# Altium project PCB_Project.PrjPcb (part 3 of 4)

## Sheet Regulators and Buck Converters.SchDoc
size A4; SheetNumber: 19; SheetTotal: 26
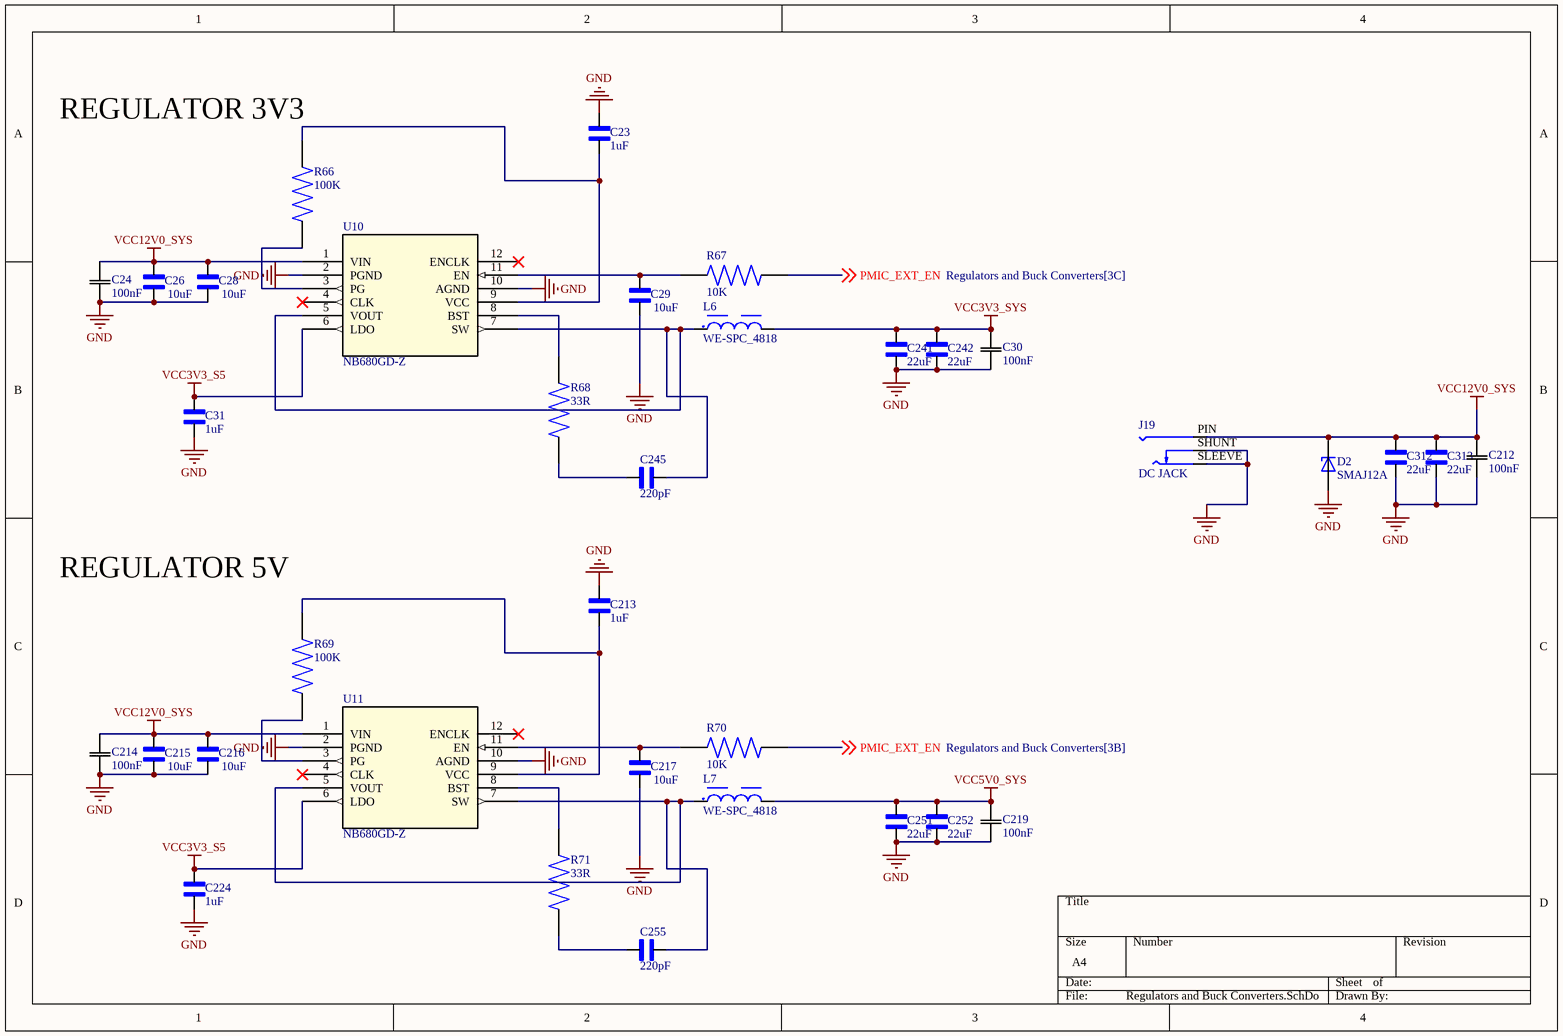
[diagram p18: Regulators and Buck Converters.SchDoc]

### Parts
C23  1uF  [CAPC1005X56N]
C24  100nF  [CAP_1005_TDK]
C26  10uF  [CAPC1005X70N]
C28  10uF  [CAPC1005X70N]
C29  10uF  [CAPC1005X70N]
C30  100nF  [CAP_1005_TDK]
C31  1uF  [CAPC1005X56N]
C212  100nF  [CAP_1005_TDK]
C213  1uF  [CAPC1005X56N]
C214  100nF  [CAP_1005_TDK]
C215  10uF  [CAPC1005X70N]
C216  10uF  [CAPC1005X70N]
C217  10uF  [CAPC1005X70N]
C219  100nF  [CAP_1005_TDK]
C224  1uF  [CAPC1005X56N]
C241  22uF  [CAPC2012X140N]
C242  22uF  [CAPC2012X140N]
C245  220pF  [CAPC1608X90]
C251  22uF  [CAPC2012X140N]
C252  22uF  [CAPC2012X140N]
C255  220pF  [CAPC1608X90]
C312  22uF  [CAPC2012X140N]
C313  22uF  [CAPC2012X140N]
D2  SMAJ12A  [DIOM4325X250N]
J19  DC JACK  [SWITCHCRAFT_RASM712PX]
L6  WE-SPC_4818  [WE-SPC_4818]
L7  WE-SPC_4818  [WE-SPC_4818]
R66  100K  [RES_ERA3ARB103V]
R67  10K  [RES_ERA3ARB103V]
R68  33R  [RES_ERA6AHD330V]
R69  100K  [RES_ERA3ARB103V]
R70  10K  [RES_ERA3ARB103V]
R71  33R  [RES_ERA6AHD330V]
U10  NB680GD-Z  [QFN-12_NB680_MNP]
U11  NB680GD-Z  [QFN-12_NB680_MNP]

### Nets
GND: C23.2 C24.1 C26.1 C28.1 C29.1 C30.1 C31.1 C212.1 C213.2 C214.1 C215.1 C216.1 C217.1 C219.1 C224.1 C241.2 C242.2 C251.2 C252.2 C312.2 C313.2 D2.A J19.SHUNT J19.SLEEVE U10.2(PGND) U10.10(AGND) U11.2(PGND) U11.10(AGND)
VCC3V3_S5: C31.2 C224.2 U10.6(LDO) U11.6(LDO)
VCC3V3_SYS: C30.2 C241.1 C242.1 L6.2
VCC5V0_SYS: C219.2 C251.1 C252.1 L7.2
VCC12V0_SYS: C24.2 C26.2 C28.2 C212.2 C214.2 C215.2 C216.2 C312.1 C313.1 D2.C J19.PIN U10.1(VIN) U11.1(VIN)
PMIC_EXT_EN: R67.2 R70.2 ; off-sheet PMIC_EXT_EN
NetC23_1: C23.1 R66.2 U10.9(VCC)
NetC29_2: C29.2 R67.1 U10.11(EN)
NetC213_1: C213.1 R69.2 U11.9(VCC)
NetC217_2: C217.2 R70.1 U11.11(EN)
NetC245_1: C245.1 L6.1 U10.5(VOUT) U10.7(SW)
NetC245_2: C245.2 R68.1
NetC255_1: C255.1 L7.1 U11.5(VOUT) U11.7(SW)
NetC255_2: C255.2 R71.1
NetR66_1: R66.1 U10.3(PG)
NetR68_2: R68.2 U10.8(BST)
NetR69_1: R69.1 U11.3(PG)
NetR71_2: R71.2 U11.8(BST)

Not connected (* = marked no-connect by the designer): U10 4(CLK)* 12(ENCLK)*; U11 4(CLK)* 12(ENCLK)*

### Notes on the sheet
- REGULATOR 3V3
- REGULATOR 5V

### Library data of the parts
C23 C31 C213 C224 = 0402ZD105KAT4A: 1 ÂµF Â±10% 10V Ceramic Capacitor X5R 0402 (1005 Metric); MF: AVX; SnapEDA_Link: https://www.snapeda.com/parts/0402ZD105KAT4A/AVX/view-part/?ref=snap; Package: 1005 AVX; Value: *; MP: 0402ZD105KAT4A; Check_prices: https://www.snapeda.com/parts/0402ZD105KAT4A/AVX/view-part/?ref=eda
C24 C30 C212 C214 C219 = C1005X7R1H104M050BB: Description; Manufacturer_Name: TDK; Copyright: Copyright (C) 2025 Ultra Librarian. All rights reserved.; Manufacturer_Part_Number: C1005X7R1H104M050BB
C26 C28 C29 C215-C217 = CL05A106MQ5NUNC: 10 ÂµF Â±20% 6.3V Ceramic Capacitor X5R 0402 (1005 Metric); MF: Samsung; SnapEDA_Link: https://www.snapeda.com/parts/CL05A106MQ5NUNC/Samsung/view-part/?ref=snap; Package: SMD-2 Samsung; Value: *; MP: CL05A106MQ5NUNC; Check_prices: https://www.snapeda.com/parts/CL05A106MQ5NUNC/Samsung/view-part/?ref=eda
C241 C242 C251 C252 C312 C313 = C0805C220J5GACTU: Capacitor, Ceramic, Cap, 22.0pF, Tol 5%, SMT, 50V, C0G | KEMET C0805C220J5GACTU; SnapEDA_Link: https://www.snapeda.com/parts/C0805C220J5GACTU/KEMET/view-part/?ref=snap; Package: 0805 Kemet; Value: *; MF: KEMET; MP: C0805C220J5GACTU; Check_prices: https://www.snapeda.com/parts/C0805C220J5GACTU/KEMET/view-part/?ref=eda
C245 C255 = CC0603KRX7R7BB221: 220 pF Â±10% 16V Ceramic Capacitor X7R 0603 (1608 Metric); MF: Yageo; SnapEDA_Link: https://www.snapeda.com/parts/CC0603KRX7R7BB221/Yageo/view-part/?ref=snap; Package: 0603 Yageo; Value: *; MP: CC0603KRX7R7BB221; Check_prices: https://www.snapeda.com/parts/CC0603KRX7R7BB221/Yageo/view-part/?ref=eda
D2 = SMAJ12A: 400W, 14V, 5%, Unidirectional, TVS; MF: Taiwan Semiconductor; SnapEDA_Link: https://www.snapeda.com/parts/SMAJ12A/taiwan/view-part/?ref=snap; Package: SMA-2 Taiwan Semiconductor; Value: *; MP: SMAJ12A; Check_prices: https://www.snapeda.com/parts/SMAJ12A/taiwan/view-part/?ref=eda
J19 = RASM712PX: Conn;AV;DC,Power;Jack;2.5mmPinSize;RtAngle;DCSeries;SMTMount | Switchcraft RASM712PX; MF: Switchcraft Inc.; SnapEDA_Link: https://www.snapeda.com/parts/RASM712PX/SWITCHCRAFT/view-part/?ref=snap; Package: None; Value: *; MP: RASM712PX; Check_prices: https://www.snapeda.com/parts/RASM712PX/SWITCHCRAFT/view-part/?ref=eda
L6 L7 = WE-SPC_4818: 10 ÂµH Shielded Drum Core, Wirewound Inductor 900 mA 248mOhm Max 1919 (4848 Metric); MF: WÃ¼rth Elektronik; MP: 74408941100; SnapEDA_Link: https://www.snapeda.com/parts/74408941100/W%25C3%25BCrth+Elektronik+Midcom/view-part/?ref=snap; Package: 1919 WÃ¼rth Elektronik; Value: *; Check_prices: https://www.snapeda.com/parts/74408941100/W%25C3%25BCrth+Elektronik+Midcom/view-part/?ref=eda
R66 R67 R69 R70 = ERA3ARB103V: MP: ERA3ARB103V; Availability: Unavailable; Package: None; Value: *; Price: None
R68 R71 = ERA6AHD330V: Package: None; MP: ERA6AHD330V; Price: None; Value: *; Availability: Unavailable
U10 U11 = NB680GD-Z: Wide Vin 4.8-26V Low Iq High Current Fixed 3.3V-8A Synchronous Buck Converter with 100mA LDO; Manufacturer_Name: Monolithic Power Systems; Copyright: Copyright (C) 2026 Ultra Librarian. All rights reserved.; Manufacturer_Part_Number: NB680GD-Z; Datasheet: https://www.monolithicpower.com/en/documentview/productdocument/index/version/2/document_type/Datasheet/lang/en/sku/NB680; RefDes: RefDes; Type: Type

## Sheet Power Supply for CPU Blocks.SchDoc
size 420 x 297 mm; SheetNumber: 20; SheetTotal: 26
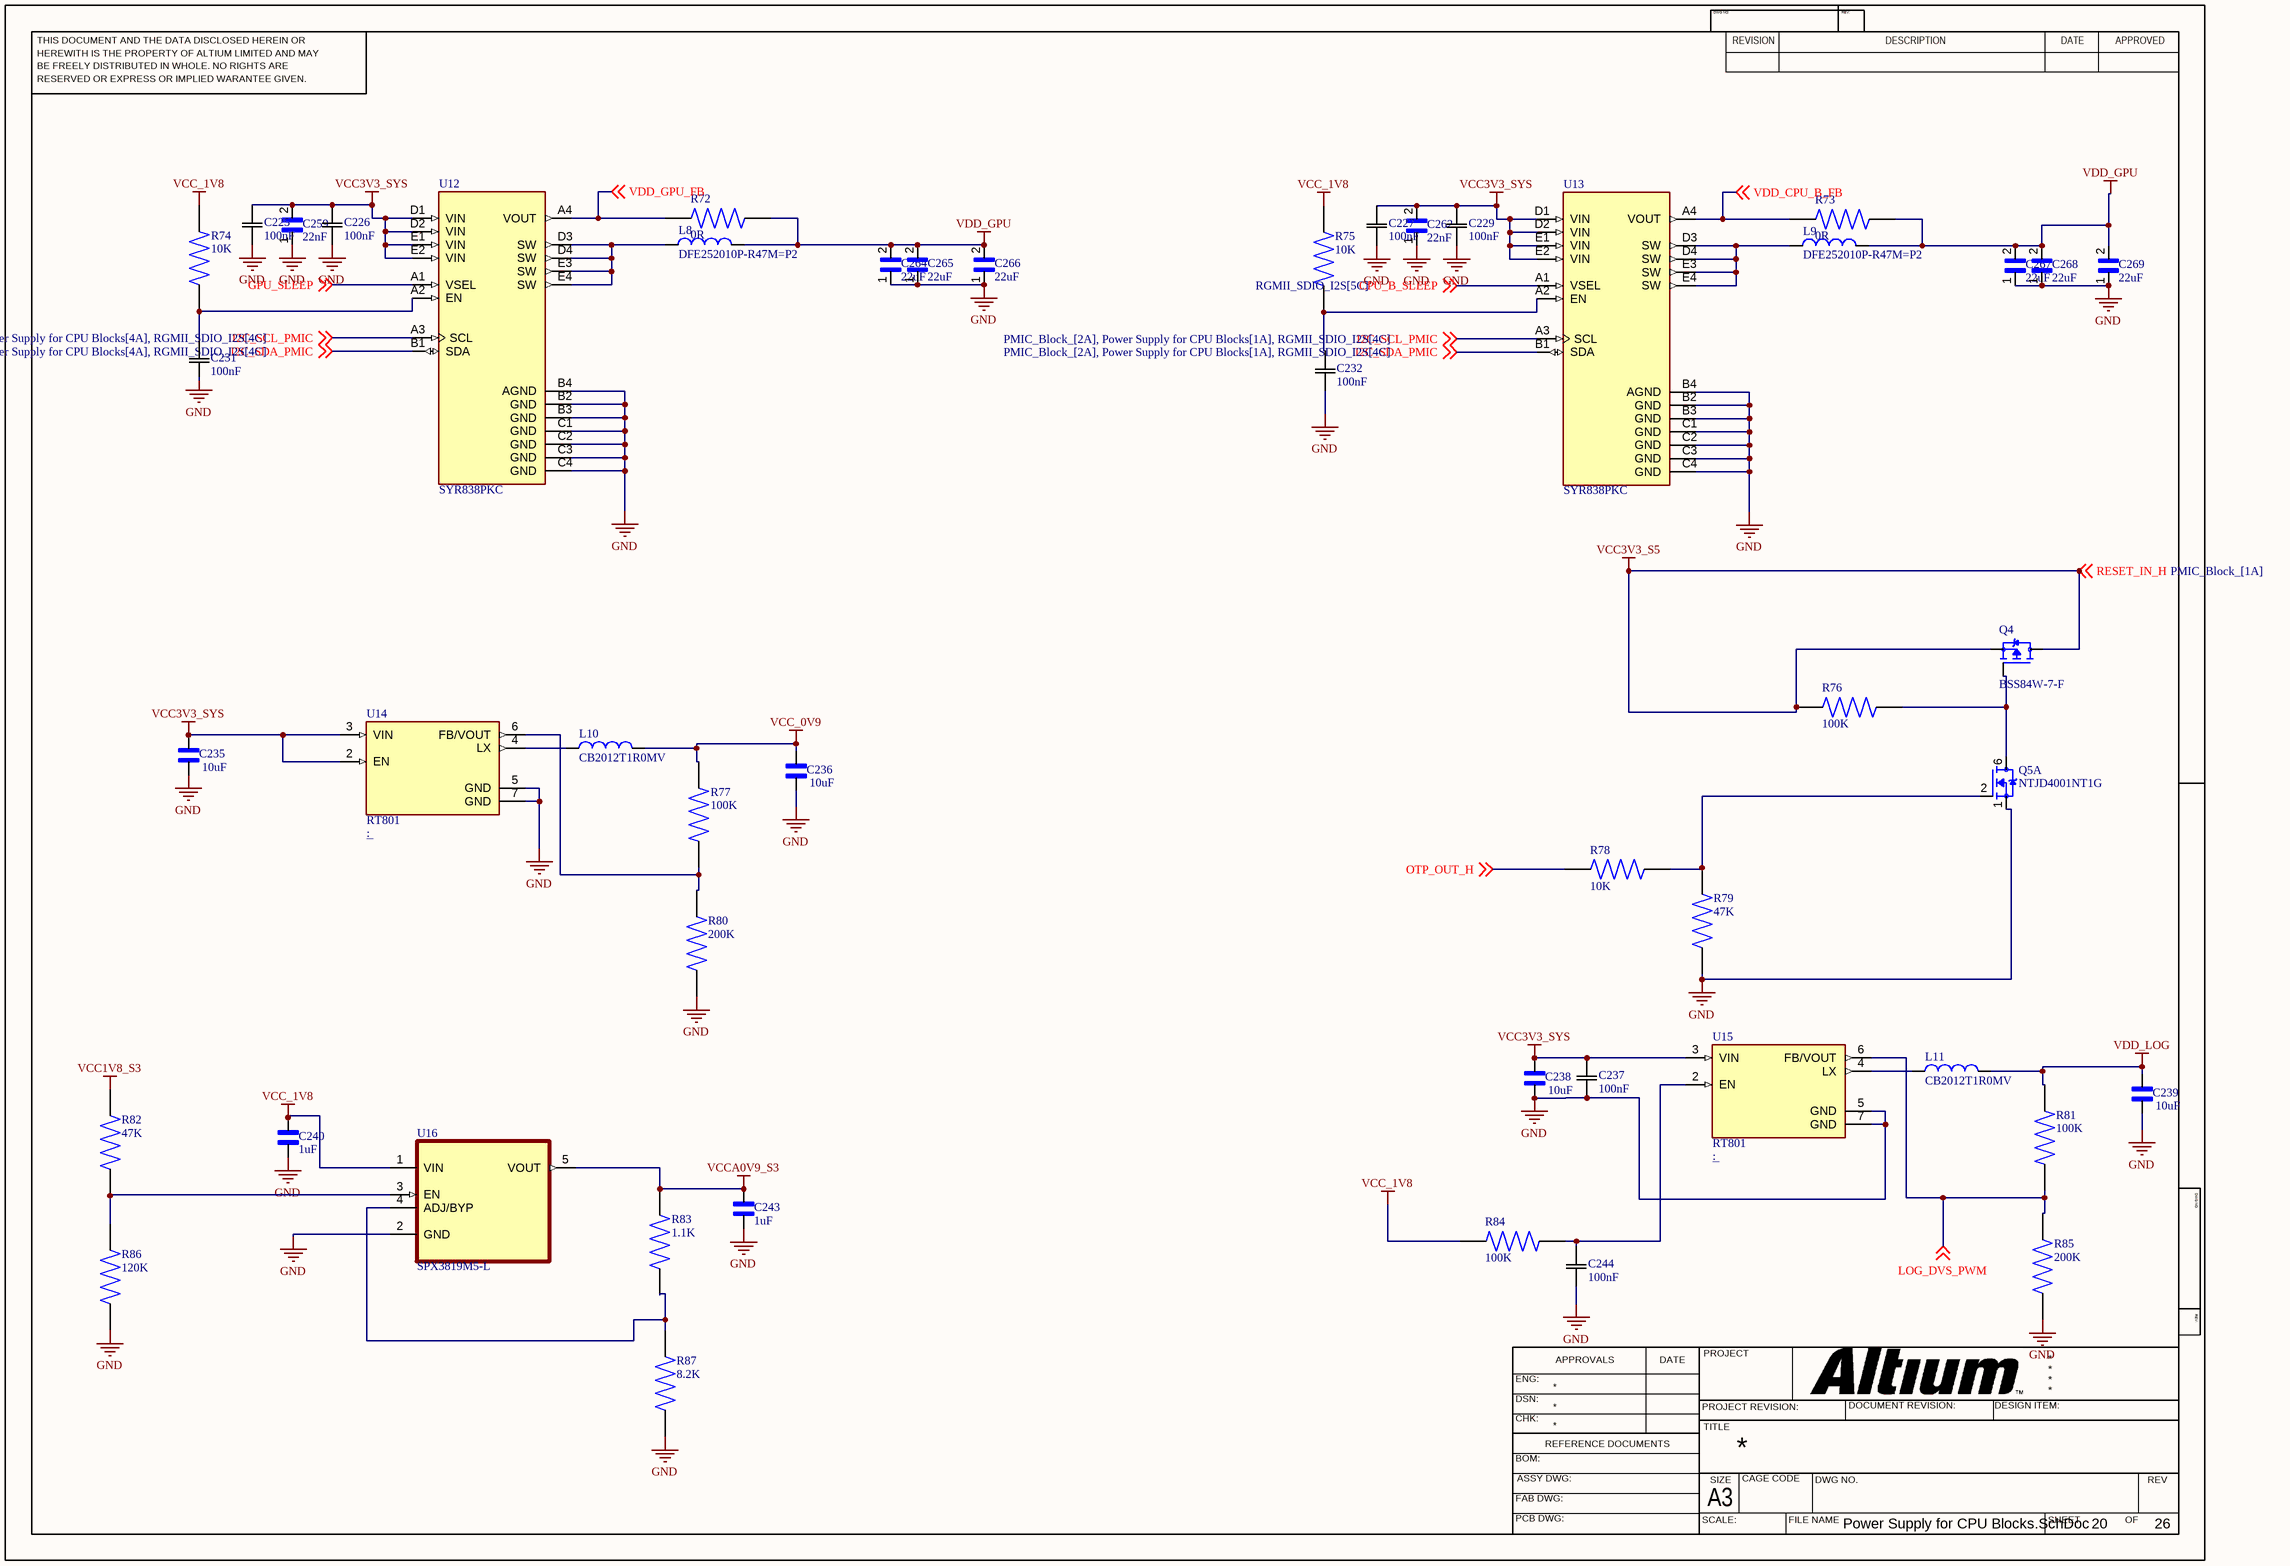
[diagram p19: Power Supply for CPU Blocks.SchDoc]

### Parts
C225  100nF  [CAP_1005_TDK]
C226  100nF  [CAP_1005_TDK]
C227  100nF  [CAP_1005_TDK]
C229  100nF  [CAP_1005_TDK]
C231  100nF  [CAP_1005_TDK]
C232  100nF  [CAP_1005_TDK]
C235  10uF  [CAPC1005X70N]
C236  10uF  [CAPC1005X70N]
C237  100nF  [CAP_1005_TDK]
C238  10uF  [CAPC1005X70N]
C239  10uF  [CAPC1005X70N]
C240  1uF  [CAPC1005X56N]
C243  1uF  [CAPC1005X56N]
C244  100nF  [CAP_1005_TDK]
C259  22nF  [CAPC6050X550N]
C262  22nF  [CAPC6050X550N]
C264  22uF  [CAPC6050X550N]
C265  22uF  [CAPC6050X550N]
C266  22uF  [CAPC6050X550N]
C267  22uF  [CAPC6050X550N]
C268  22uF  [CAPC6050X550N]
C269  22uF  [CAPC6050X550N]
L8  DFE252010P-R47M=P2  [INDC2520X100N]
L9  DFE252010P-R47M=P2  [INDC2520X100N]
L10  CB2012T1R0MV  [INDC2012X145N]
L11  CB2012T1R0MV  [INDC2012X145N]
Q4  BSS84W-7-F  [SOT65P222X110-3N]
Q5  NTJD4001NT1G  [SOT65P210X110-6N]  (part A of 2)
R72  0R  [RES_ERJH6G0R00V]
R73  0R  [RES_ERJH6G0R00V]
R74  10K  [RES_ERA3ARB103V]
R75  10K  [RES_ERA3ARB103V]
R76  100K  [RES_ERA3ARB103V]
R77  100K  [RES_ERA3ARB103V]
R78  10K  [RES_ERA3ARB103V]
R79  47K  [RES_ERA2ARC473X]
R80  200K  [RES_ERJP06D2003V]
R81  100K  [RES_ERA3ARB103V]
R82  47K  [RES_ERA2ARC473X]
R83  1.1K  [RESC1608X50N]
R84  100K  [RES_ERA3ARB103V]
R85  200K  [RES_ERJP06D2003V]
R86  120K  [RES_ERA8AEB124V]
R87  8.2K  [RES_ERA2APB822X]
U12  SYR838PKC  [BGA20N40P5X4_196X156X66N]
U13  SYR838PKC  [BGA20N40P5X4_196X156X66N]
U14  RT801  [SON65P200X200X80-7N]
U15  RT801  [SON65P200X200X80-7N]
U16  SPX3819M5-L  [SOT95P280X145-5N]

### Nets
GND: C225.1 C226.1 C227.1 C229.1 C231.1 C232.1 C235.1 C236.1 C237.1 C238.1 C239.1 C240.1 C243.1 C244.1 C259.1 C262.1 C264.1 C265.1 C266.1 C267.1 C268.1 C269.1 Q5.1(S1) R79.1 R80.1 R85.1 R86.1 R87.1 U12.B2(GND) U12.B3(GND) U12.B4(AGND) U12.C1(GND) U12.C2(GND) U12.C3(GND) U12.C4(GND) U13.B2(GND) U13.B3(GND) U13.B4(AGND) U13.C1(GND) U13.C2(GND) U13.C3(GND) U13.C4(GND) U14.5(GND) U14.7(GND) U15.5(GND) U15.7(GND) U16.2(GND)
VCC1V8_S3: R82.2
VCC3V3_S5: Q4.2(S) Q4.3(D) R76.2 ; off-sheet RESET_IN_H  [also labelled RESET_IN_H]
VCC3V3_SYS: C225.2 C226.2 C227.2 C229.2 C235.2 C237.2 C238.2 C259.2 C262.2 U12.D1(VIN) U12.D2(VIN) U12.E1(VIN) U12.E2(VIN) U13.D1(VIN) U13.D2(VIN) U13.E1(VIN) U13.E2(VIN) U14.2(EN) U14.3(VIN) U15.3(VIN)
VCC_0V9: C236.2 L10.2 R77.2
VCC_1V8: C240.2 R74.2 R75.2 R84.2 U16.1(VIN)
VCCA0V9_S3: C243.2 R83.2 U16.5(VOUT)
VDD_GPU: C264.2 C265.2 C266.2 C267.2 C268.2 C269.2 L8.2 L9.2 R72.2 R73.2
VDD_LOG: C239.2 L11.2 R81.2
CPU_B_SLEEP: U13.A1(VSEL) ; off-sheet CPU_B_SLEEP
GPU_SLEEP: U12.A1(VSEL) ; off-sheet GPU_SLEEP
I2C_SCL_PMIC: U12.A3(SCL) U13.A3(SCL) ; off-sheet I2C_SCL_PMIC
I2C_SDA_PMIC: U12.B1(SDA) U13.B1(SDA) ; off-sheet I2C_SDA_PMIC
LOG_DVS_PWM: R81.1 R85.2 U15.6(FB/VOUT) ; off-sheet LOG_DVS_PWM
OTP_OUT_H: R78.2 ; off-sheet OTP_OUT_H
VDD_CPU_B_FB: R73.1 U13.A4(VOUT) ; off-sheet VDD_CPU_B_FB
VDD_GPU_FB: R72.1 U12.A4(VOUT) ; off-sheet VDD_GPU_FB
NetC231_2: C231.2 R74.1 U12.A2(EN)
NetC232_2: C232.2 R75.1 U13.A2(EN)
NetC244_2: C244.2 R84.1 U15.2(EN)
NetL8_1: L8.1 U12.D3(SW) U12.D4(SW) U12.E3(SW) U12.E4(SW)
NetL9_1: L9.1 U13.D3(SW) U13.D4(SW) U13.E3(SW) U13.E4(SW)
NetL10_1: L10.1 U14.4(LX)
NetL11_1: L11.1 U15.4(LX)
NetQ4_1: Q4.1(G) Q5.6(D1) R76.1
NetQ5_2: Q5.2(G1) R78.1 R79.2
NetR77_1: R77.1 R80.2 U14.6(FB/VOUT)
NetR82_1: R82.1 R86.2 U16.3(EN)
NetR83_1: R83.1 R87.2 U16.4(ADJ/BYP)

### Notes on the sheet
- THIS DOCUMENT AND THE DATA DISCLOSED HEREIN OR
- HEREWITH IS THE PROPERTY OF ALTIUM LIMITED AND MAY
- DWG NO:
- REVISION
- REV:
- DESCRIPTION
- DATE
- APPROVED
- BE FREELY DISTRIBUTED IN WHOLE. NO RIGHTS ARE
- RESERVED OR EXPRESS OR IMPLIED WARANTEE GIVEN.
- ENG:
- APPROVALS
- PROJECT
- DSN:
- CHK:
- REFERENCE DOCUMENTS
- PROJECT REVISION:
- TITLE
- DOCUMENT REVISION:
- DESIGN ITEM:
- BOM:
- FAB DWG:
- PCB DWG:
- ASSY DWG:
- SCALE:
- A3
- SIZE
- CAGE CODE
- FILE NAME
- DWG NO.
- SHEET
- OF
- REV

### Library data of the parts
C225-C227 C229 C231 C232 C237 C244 = C1005X7R1H104M050BB: Description; Manufacturer_Name: TDK; Copyright: Copyright (C) 2025 Ultra Librarian. All rights reserved.; Manufacturer_Part_Number: C1005X7R1H104M050BB
C235 C236 C238 C239 = CL05A106MQ5NUNC: as C26 on sheet Regulators and Buck Converters; SnapEDA_Link: https://www.snapeda.com/parts/CL05A106MQ5NUNC/Samsung/view-part/?ref=snap; Package: SMD-2 Samsung; Value: *; MP: CL05A106MQ5NUNC; Check_prices: https://www.snapeda.com/parts/CL05A106MQ5NUNC/Samsung/view-part/?ref=eda
C240 C243 = 0402ZD105KAT4A: as C23 on sheet Regulators and Buck Converters; SnapEDA_Link: https://www.snapeda.com/parts/0402ZD105KAT4A/AVX/view-part/?ref=snap; Package: 1005 AVX; Value: *; MP: 0402ZD105KAT4A; Check_prices: https://www.snapeda.com/parts/0402ZD105KAT4A/AVX/view-part/?ref=eda
C259 C262 C264-C269 = CKG57NX7S1H226M500JJ: 22ÂµF Â±20% 50V Ceramic Capacitor X7S Stacked SMD, 2 J-Lead; MP: CKG57NX7S1H226M500JJ; Package: None; Availability: Unavailable; Price: None; Value: *
L8 L9 = DFE252010P-R47M=P2: INDUCTOR, SHLD, 0.47UH, 20%, 4.1A, 1008; Package: None; Price: None; Value: *; MP: DFE252010P-R47M=P2; Availability: Unavailable
L10 L11 = CB2012T1R0MV: 1 ÂµH Unshielded Drum Core, Wirewound Inductor 700 mA 195mOhm Max 0805 (2012 Metric); MF: Taiyo Yuden; SnapEDA_Link: https://www.snapeda.com/parts/CB2012T1R0MV/Taiyo+Yuden/view-part/?ref=snap; Package: 2012 Taiyo Yuden; Value: *; MP: CB2012T1R0MV; Check_prices: https://www.snapeda.com/parts/CB2012T1R0MV/Taiyo+Yuden/view-part/?ref=eda
Q4 = BSS84W-7-F: P-Channel 50 V 130mA (Ta) 200mW (Ta) Surface Mount SOT-323; MF: Diodes Inc.; SnapEDA_Link: https://www.snapeda.com/parts/BSS84W-7-F/Diodes+Inc./view-part/?ref=snap; Availability: In Stock; Check_prices: https://www.snapeda.com/parts/BSS84W-7-F/Diodes+Inc./view-part/?ref=eda; MP: BSS84W-7-F; Price: None; Purchase-URL: https://pricing.snapeda.com/search/part/BSS84W-7-F/?ref=eda; Package: SOT-323 Diodes Inc.; Value: *
Q5 = NTJD4001NT1G: Mosfet Array 2 N-Channel (Dual) 30V 250mA 272mW Surface Mount SC-88/SC70-6/SOT-363; MF: ON Semiconductor; SnapEDA_Link: https://www.snapeda.com/parts/NTJD4001NT1G/Onsemi/view-part/?ref=snap; Package: SC-88-6 ON Semiconductor; Value: *; MP: NTJD4001NT1G; Check_prices: https://www.snapeda.com/parts/NTJD4001NT1G/Onsemi/view-part/?ref=eda
R72 R73 = ERJH6G0R00V: MP: ERJH6G0R00V; Value: *; Availability: Unavailable; Price: None; Package: None
R74-R78 R81 R84 = ERA3ARB103V: MP: ERA3ARB103V; Availability: Unavailable; Package: None; Value: *; Price: None
R79 R82 = ERA2ARC473X: Value: *; MP: ERA2ARC473X; Package: None; Availability: Unavailable; Price: None
R80 R85 = ERJP06D2003V: Package: None; Value: *; Price: None; MP: ERJP06D2003V; Availability: Unavailable
R83 = ERJP08F1101V: Package: None; Value: *; MP: ERJP08F1101V; Price: None; Availability: Unavailable
R86 = ERA8AEB124V: Availability: Unavailable; MP: ERA8AEB124V; Price: None; Package: None; Value: *
R87 = ERA2APB822X: Price: None; Value: *; Availability: Unavailable; Package: None; MP: ERA2APB822X
U12 U13 = SYR838PKC: MF: Silergy; SnapEDA_Link: https://www.snapeda.com/parts/SYR838PKC/Silergy/view-part/?ref=snap; Package: None; Value: *; MP: SYR838PKC; Check_prices: https://www.snapeda.com/parts/SYR838PKC/Silergy/view-part/?ref=eda
U14 U15 = RT8010GQW: Buck Switching Regulator IC Positive Adjustable 0.6V 1 Output 1A 6-WDFN Exposed Pad; MF: Richtek USA; SnapEDA_Link: https://www.snapeda.com/parts/RT8010GQW/Richtek%20USA%20Inc./view-part/641358/?ref=snap; Value: *; MP: RT8010GQW; Package: WDFN-6 Richtek
U16 = SPX3819M5-L: Linear Voltage Regulator IC Positive Adjustable 1 Output 500mA SOT-23-5; MF: MaxLinear, Inc.; MP: SPX3819M5-L/TR; SnapEDA_Link: https://www.snapeda.com/parts/SPX3819M5-L/TR/MaxLinear/view-part/?ref=snap; Package: SOT-23-5 Exar; Value: *; Check_prices: https://www.snapeda.com/parts/SPX3819M5-L/TR/MaxLinear/view-part/?ref=eda

## Sheet MIPI CSI 0 and 1 Connectors.SchDoc
size 420 x 297 mm; SheetNumber: 21; SheetTotal: 26
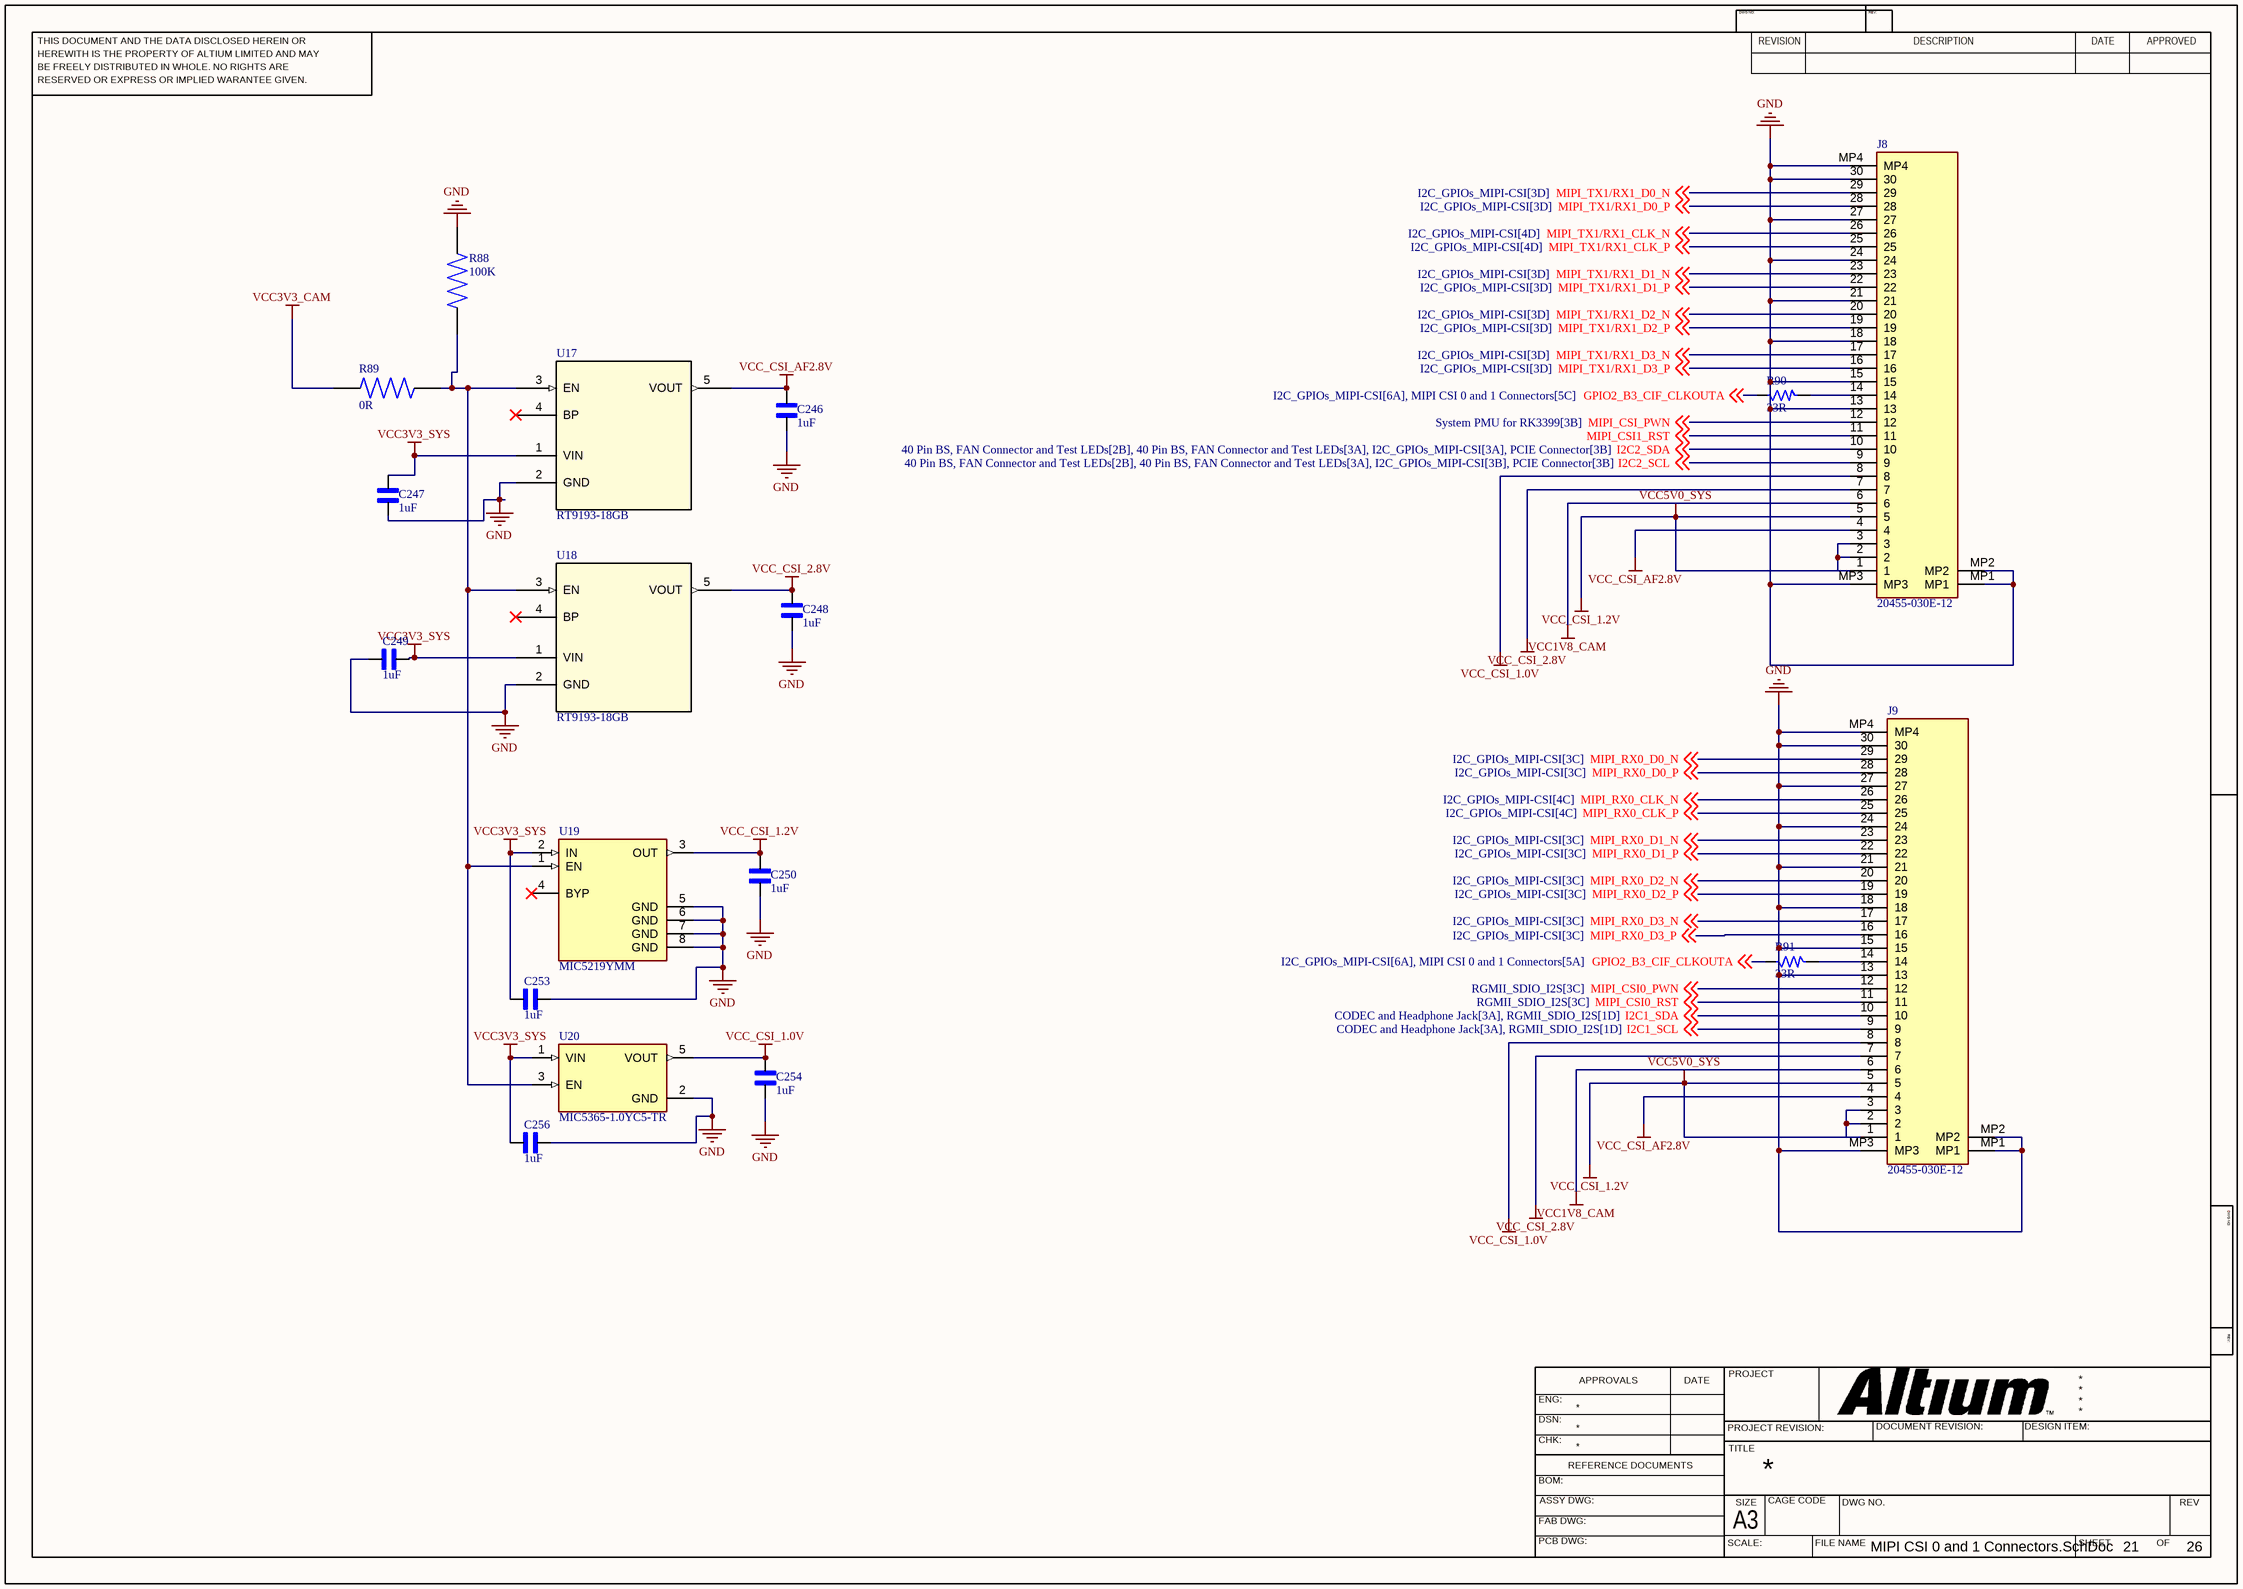
[diagram p20: MIPI CSI 0 and 1 Connectors.SchDoc]

### Parts
C246  1uF  [CAPC1005X56N]
C247  1uF  [CAPC1005X56N]
C248  1uF  [CAPC1005X56N]
C249  1uF  [CAPC1005X56N]
C250  1uF  [CAPC1005X56N]
C253  1uF  [CAPC1005X56N]
C254  1uF  [CAPC1005X56N]
C256  1uF  [CAPC1005X56N]
J8  20455-030E-12  [20455030E12]
J9  20455-030E-12  [20455030E12]
R88  100K  [RES_ERA3ARB103V]
R89  0R  [RES_ERJH6G0R00V]
R90  33R  [RESC1608X50N]
R91  33R  [RESC1608X50N]
U17  RT9193-18GB  [SOT-23-5_RIT]
U18  RT9193-18GB  [SOT-23-5_RIT]
U19  MIC5219YMM  [SOP65P490X110-8N]
U20  MIC5365-1.0YC5-TR  [SOT65P210X110-5N]

### Nets
GND: C246.1 C247.1 C248.1 C249.2 C250.1 C253.1 C254.1 C256.1 J8.13 J8.15 J8.18 J8.21 J8.24 J8.27 J8.30 J8.MP1 J8.MP2 J8.MP3 J8.MP4 J9.13 J9.15 J9.18 J9.21 J9.24 J9.27 J9.30 J9.MP1 J9.MP2 J9.MP3 J9.MP4 R88.2 U17.2(GND) U18.2(GND) U19.5(GND) U19.6(GND) U19.7(GND) U19.8(GND) U20.2(GND)
VCC1V8_CAM: J8.6 J9.6
VCC3V3_CAM: R89.1
VCC3V3_SYS: C247.2 C249.1 C253.2 C256.2 U17.1(VIN) U18.1(VIN) U19.2(IN) U20.1(VIN)
VCC5V0_SYS: C250.2 J8.1 J8.2 J8.3 J8.5 J9.1 J9.2 J9.3 J9.5 U19.3(OUT)  [also labelled VCC_CSI_1.2V]
VCC_CSI_1.0V: C254.2 J8.8 J9.8 U20.5(VOUT)
VCC_CSI_2.8V: C248.2 J8.7 J9.7 U18.5(VOUT)
VCC_CSI_AF2.8V: C246.2 J8.4 J9.4 U17.5(VOUT)
GPIO2_B3_CIF_CLKOUTA: R90.1 R91.1 ; off-sheet GPIO2_B3_CIF_CLKOUTA
I2C1_SCL: J9.9 ; off-sheet I2C1_SCL
I2C1_SDA: J9.10 ; off-sheet I2C1_SDA
I2C2_SCL: J8.9 ; off-sheet I2C2_SCL
I2C2_SDA: J8.10 ; off-sheet I2C2_SDA
MIPI_CSI0_PWN: J9.12 ; off-sheet MIPI_CSI0_PWN
MIPI_CSI0_RST: J9.11 ; off-sheet MIPI_CSI0_RST
MIPI_CSI1_RST: J8.11 ; off-sheet MIPI_CSI1_RST
MIPI_CSI_PWN: J8.12 ; off-sheet MIPI_CSI_PWN
MIPI_RX0_CLK_N: J9.26 ; off-sheet MIPI_RX0_CLK_N
MIPI_RX0_CLK_P: J9.25 ; off-sheet MIPI_RX0_CLK_P
MIPI_RX0_D0_N: J9.29 ; off-sheet MIPI_RX0_D0_N
MIPI_RX0_D0_P: J9.28 ; off-sheet MIPI_RX0_D0_P
MIPI_RX0_D1_N: J9.23 ; off-sheet MIPI_RX0_D1_N
MIPI_RX0_D1_P: J9.22 ; off-sheet MIPI_RX0_D1_P
MIPI_RX0_D2_N: J9.20 ; off-sheet MIPI_RX0_D2_N
MIPI_RX0_D2_P: J9.19 ; off-sheet MIPI_RX0_D2_P
MIPI_RX0_D3_N: J9.17 ; off-sheet MIPI_RX0_D3_N
MIPI_RX0_D3_P: J9.16 ; off-sheet MIPI_RX0_D3_P
MIPI_TX1/RX1_CLK_N: J8.26 ; off-sheet MIPI_TX1/RX1_CLK_N
MIPI_TX1/RX1_CLK_P: J8.25 ; off-sheet MIPI_TX1/RX1_CLK_P
MIPI_TX1/RX1_D0_N: J8.29 ; off-sheet MIPI_TX1/RX1_D0_N
MIPI_TX1/RX1_D0_P: J8.28 ; off-sheet MIPI_TX1/RX1_D0_P
MIPI_TX1/RX1_D1_N: J8.23 ; off-sheet MIPI_TX1/RX1_D1_N
MIPI_TX1/RX1_D1_P: J8.22 ; off-sheet MIPI_TX1/RX1_D1_P
MIPI_TX1/RX1_D2_N: J8.20 ; off-sheet MIPI_TX1/RX1_D2_N
MIPI_TX1/RX1_D2_P: J8.19 ; off-sheet MIPI_TX1/RX1_D2_P
MIPI_TX1/RX1_D3_N: J8.17 ; off-sheet MIPI_TX1/RX1_D3_N
MIPI_TX1/RX1_D3_P: J8.16 ; off-sheet MIPI_TX1/RX1_D3_P
NetJ8_14: J8.14 R90.2
NetJ9_14: J9.14 R91.2
NetR88_1: R88.1 R89.2 U17.3(EN) U18.3(EN) U19.1(EN) U20.3(EN)

Not connected (* = marked no-connect by the designer): U17 4(BP)*; U18 4(BP)*; U19 4(BYP)*

### Notes on the sheet
- THIS DOCUMENT AND THE DATA DISCLOSED HEREIN OR
- HEREWITH IS THE PROPERTY OF ALTIUM LIMITED AND MAY
- DWG NO:
- REVISION
- REV:
- DESCRIPTION
- DATE
- APPROVED
- BE FREELY DISTRIBUTED IN WHOLE. NO RIGHTS ARE
- RESERVED OR EXPRESS OR IMPLIED WARANTEE GIVEN.
- ENG:
- APPROVALS
- PROJECT
- DSN:
- CHK:
- REFERENCE DOCUMENTS
- PROJECT REVISION:
- TITLE
- DOCUMENT REVISION:
- DESIGN ITEM:
- BOM:
- FAB DWG:
- PCB DWG:
- ASSY DWG:
- SCALE:
- A3
- SIZE
- CAGE CODE
- FILE NAME
- DWG NO.
- SHEET
- OF
- REV

### Library data of the parts
C246-C250 C253 C254 C256 = 0402ZD105KAT4A: as C23 on sheet Regulators and Buck Converters; SnapEDA_Link: https://www.snapeda.com/parts/0402ZD105KAT4A/AVX/view-part/?ref=snap; Package: 1005 AVX; Value: *; MP: 0402ZD105KAT4A; Check_prices: https://www.snapeda.com/parts/0402ZD105KAT4A/AVX/view-part/?ref=eda
J8 J9 = 20455-030E-12: Board Connector, 30 Contact(s), 1 Row(s), Female, Right Angle, Surface Mount Terminal, Receptacle; Manufacturer_Name: I-Pex; Geometry.Height: 1.1mm; Manufacturer_Part_Number: 20455-030E-12; Mouser Part Number: *; Mouser Price/Stock: *; Arrow Part Number: *; Arrow Price/Stock: *; Datasheet Link: https://www.datasheet5.com/part/20455-030E-12/I-PEX%20Co%20Ltd
R88 = ERA3ARB103V: MP: ERA3ARB103V; Availability: Unavailable; Package: None; Value: *; Price: None
R89 = ERJH6G0R00V: MP: ERJH6G0R00V; Value: *; Availability: Unavailable; Price: None; Package: None
R90 R91 = RES_33R-0.1W-1%-0402: 33 Ohms ±1% 0.1W, 1/10W Chip Resistor 0402 (1005 Metric) Automotive AEC-Q200 Thick Film; Manufacturer: Panasonic Electronic Components; Manufacturer Part Number: ERJ-2RKF33R0X; Case/Package: 0402; Supplier-1: Digikey
U17 U18 = RT9193-18GB: Description; Manufacturer_Name: Richtek Technology; Copyright: Copyright (C) 2026 Ultra Librarian. All rights reserved.; Manufacturer_Part_Number: RT9193-18GB; RefDes: RefDes; Type: Type
U19 = MIC5219YMM: MIC5219 Series 500 mA ADJ Output Voltage Surface Mount LDO Regulator - MSOP-8; MF: Microchip; SnapEDA_Link: https://www.snapeda.com/parts/MIC5219YMM/Microchip+Technology/view-part/?ref=snap; Package: MSOP-8 Microchip; Value: *; MP: MIC5219YMM; Check_prices: https://www.snapeda.com/parts/MIC5219YMM/Microchip+Technology/view-part/?ref=eda
U20 = MIC5365-1.0YC5-TR: Linear Voltage Regulator IC Positive Fixed 1 Output 150mA SC-70-5; MF: Microchip; SnapEDA_Link: https://www.snapeda.com/parts/MIC5365-1.0YC5-TR/Microchip+Technology/view-part/?ref=snap; Package: SC-70-5 Microchip; Value: *; MP: MIC5365-1.0YC5-TR; Check_prices: https://www.snapeda.com/parts/MIC5365-1.0YC5-TR/Microchip+Technology/view-part/?ref=eda

## Sheet EDP and MIPI DSI Connectors.SchDoc
size A4; SheetNumber: 22; SheetTotal: 26
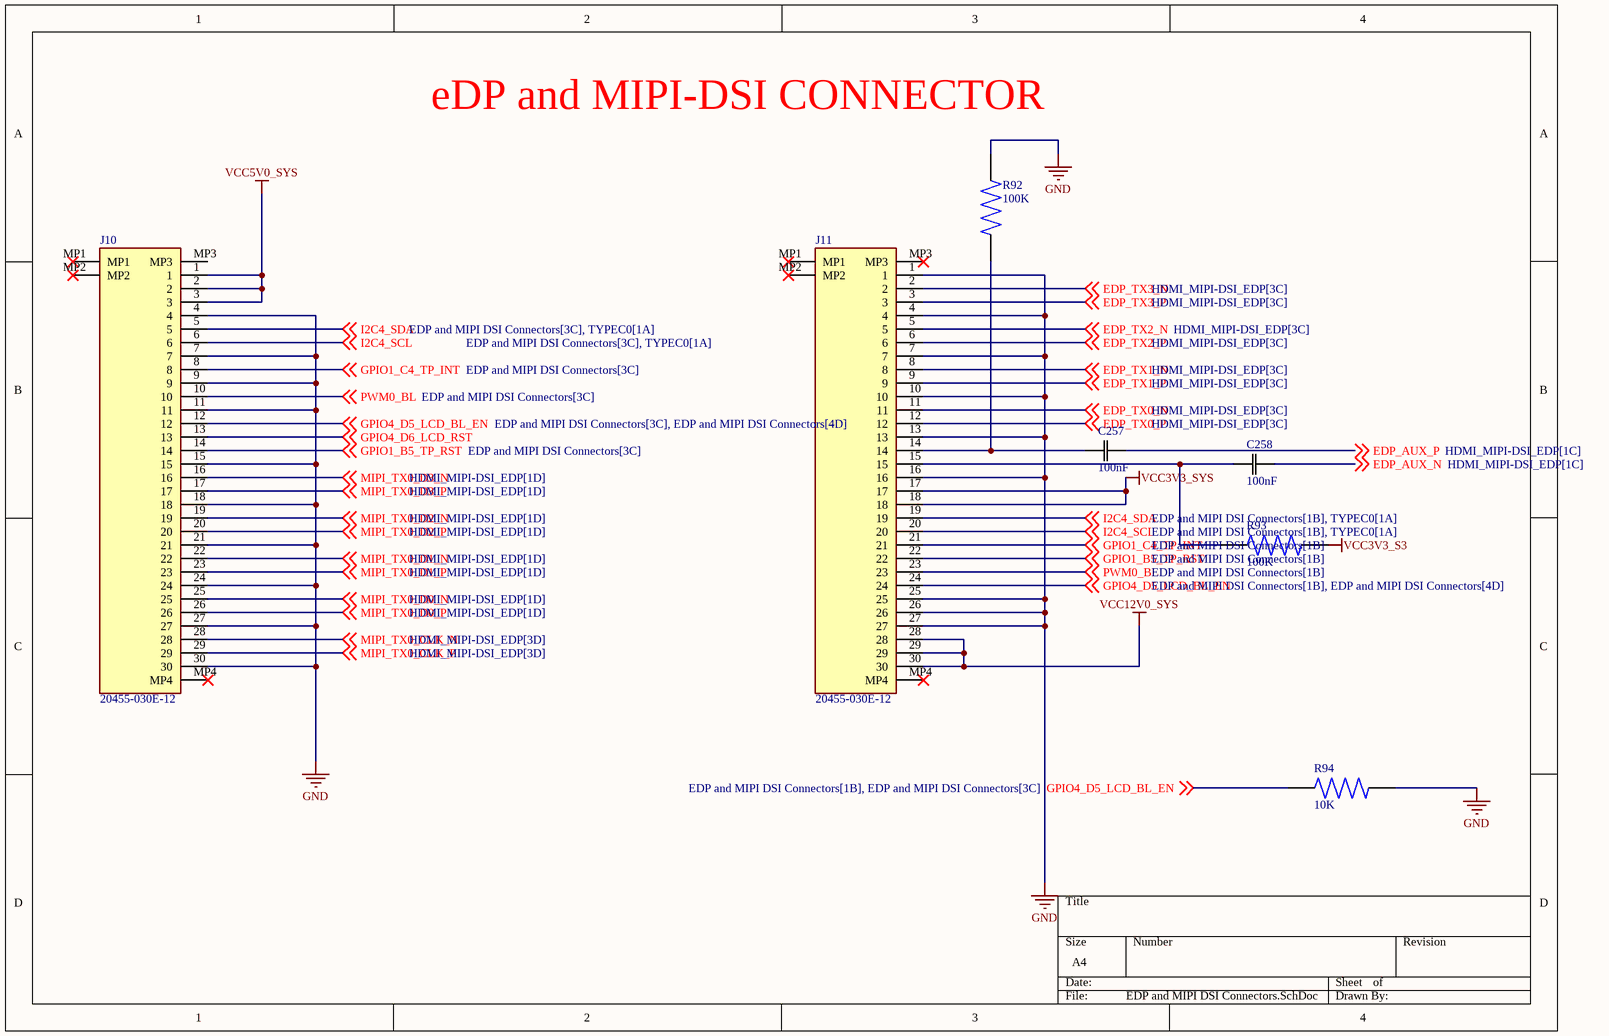
[diagram p21: EDP and MIPI DSI Connectors.SchDoc]

### Parts
C257  100nF  [CAP_1005_TDK]
C258  100nF  [CAP_1005_TDK]
J10  20455-030E-12  [20455030E12]
J11  20455-030E-12  [20455030E12]
R92  100K  [RES_ERA3ARB103V]
R93  100K  [RES_ERA3ARB103V]
R94  10K  [RES_ERA3ARB103V]

### Nets
GND: J10.4 J10.7 J10.9 J10.11 J10.15 J10.18 J10.21 J10.24 J10.27 J10.30 J11.1 J11.4 J11.7 J11.10 J11.13 J11.16 J11.25 J11.26 J11.27 R92.2 R94.1
VCC3V3_S3: R93.1
VCC3V3_SYS: J11.17 J11.18
VCC5V0_SYS: J10.1 J10.2 J10.3
VCC12V0_SYS: J11.28 J11.29 J11.30
EDP_AUX_N: C258.1 ; off-sheet EDP_AUX_N
EDP_AUX_P: C257.1 ; off-sheet EDP_AUX_P
EDP_TX0_N: J11.11 ; off-sheet EDP_TX0_N
EDP_TX0_P: J11.12 ; off-sheet EDP_TX0_P
EDP_TX1_N: J11.8 ; off-sheet EDP_TX1_N
EDP_TX1_P: J11.9 ; off-sheet EDP_TX1_P
EDP_TX2_N: J11.5 ; off-sheet EDP_TX2_N
EDP_TX2_P: J11.6 ; off-sheet EDP_TX2_P
EDP_TX3_N: J11.2 ; off-sheet EDP_TX3_N
EDP_TX3_P: J11.3 ; off-sheet EDP_TX3_P
GPIO1_B5_TP_RST: J10.14 J11.22 ; off-sheet GPIO1_B5_TP_RST
GPIO1_C4_TP_INT: J10.8 J11.21 ; off-sheet GPIO1_C4_TP_INT
GPIO4_D5_LCD_BL_EN: J10.12 J11.24 R94.2 ; off-sheet GPIO4_D5_LCD_BL_EN
GPIO4_D6_LCD_RST: J10.13 ; off-sheet GPIO4_D6_LCD_RST
I2C4_SCL: J10.6 J11.20 ; off-sheet I2C4_SCL
I2C4_SDA: J10.5 J11.19 ; off-sheet I2C4_SDA
MIPI_TX0_CLK_N: J10.28 ; off-sheet MIPI_TX0_CLK_N
MIPI_TX0_CLK_P: J10.29 ; off-sheet MIPI_TX0_CLK_P
MIPI_TX0_D0_N: J10.25 ; off-sheet MIPI_TX0_D0_N
MIPI_TX0_D0_P: J10.26 ; off-sheet MIPI_TX0_D0_P
MIPI_TX0_D1_N: J10.22 ; off-sheet MIPI_TX0_D1_N
MIPI_TX0_D1_P: J10.23 ; off-sheet MIPI_TX0_D1_P
MIPI_TX0_D2_N: J10.19 ; off-sheet MIPI_TX0_D2_N
MIPI_TX0_D2_P: J10.20 ; off-sheet MIPI_TX0_D2_P
MIPI_TX0_D3_N: J10.16 ; off-sheet MIPI_TX0_D3_N
MIPI_TX0_D3_P: J10.17 ; off-sheet MIPI_TX0_D3_P
PWM0_BL: J10.10 J11.23 ; off-sheet PWM0_BL
NetC257_2: C257.2 J11.14 R92.1
NetC258_2: C258.2 J11.15 R93.2

Not connected (* = marked no-connect by the designer): J10 MP1* MP2* MP3 MP4*; J11 MP1* MP2* MP3* MP4*

### Notes on the sheet
- eDP and MIPI-DSI CONNECTOR

### Library data of the parts
C257 C258 = C1005X7R1H104M050BB: Description; Manufacturer_Name: TDK; Copyright: Copyright (C) 2025 Ultra Librarian. All rights reserved.; Manufacturer_Part_Number: C1005X7R1H104M050BB
J10 J11 = 20455-030E-12: as J8 on sheet MIPI CSI 0 and 1 Connectors; Manufacturer_Part_Number: 20455-030E-12; Mouser Part Number: *; Mouser Price/Stock: *; Arrow Part Number: *; Arrow Price/Stock: *; Datasheet Link: https://www.datasheet5.com/part/20455-030E-12/I-PEX%20Co%20Ltd
R92-R94 = ERA3ARB103V: MP: ERA3ARB103V; Availability: Unavailable; Package: None; Value: *; Price: None

## Sheet CODEC and Headphone Jack.SchDoc
size A4; SheetNumber: 23; SheetTotal: 26
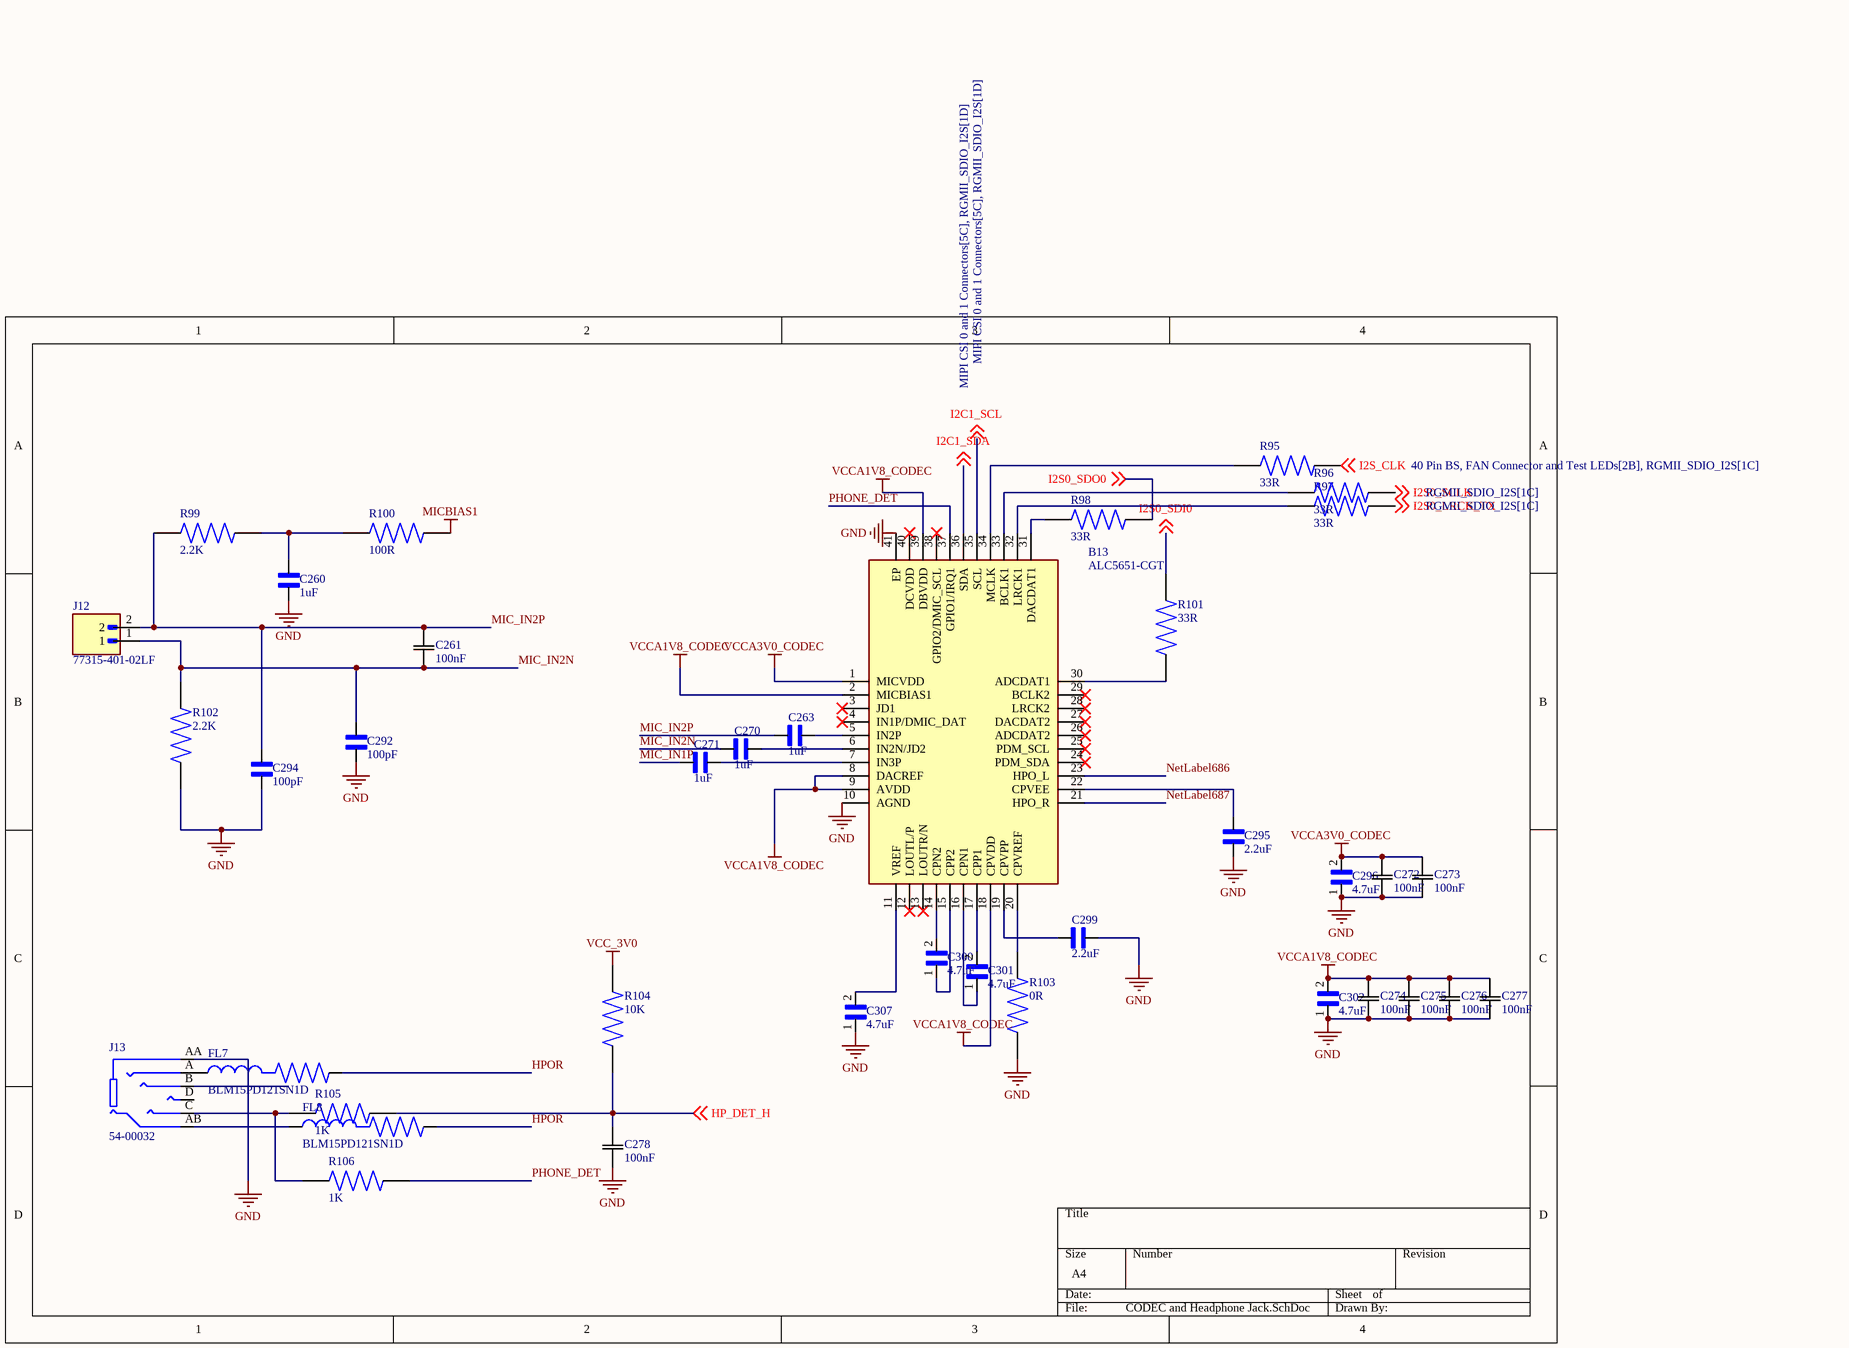
[diagram p22: CODEC and Headphone Jack.SchDoc]

### Parts
B13  ALC5651-CGT  [QFN40P500X500X90-41N-D]
C260  1uF  [CAPC1005X56N]
C261  100nF  [CAP_1005_TDK]
C263  1uF  [CAPC1005X56N]
C270  1uF  [CAPC1005X56N]
C271  1uF  [CAPC1005X56N]
C272  100nF  [CAP_1005_TDK]
C273  100nF  [CAP_1005_TDK]
C274  100nF  [CAP_1005_TDK]
C275  100nF  [CAP_1005_TDK]
C276  100nF  [CAP_1005_TDK]
C277  100nF  [CAP_1005_TDK]
C278  100nF  [CAP_1005_TDK]
C292  100pF  [CAPC2012X140N]
C294  100pF  [CAPC2012X140N]
C295  2.2uF  [CAPC3225X140N]
C296  4.7uF  [CAPC6050X350N]
C299  2.2uF  [CAPC3225X140N]
C300  4.7uF  [CAPC6050X350N]
C301  4.7uF  [CAPC6050X350N]
C302  4.7uF  [CAPC6050X350N]
C307  4.7uF  [CAPC6050X350N]
FL7  BLM15PD121SN1D  [BEADC1005X55N]
FL8  BLM15PD121SN1D  [BEADC1005X55N]
J12  77315-401-02LF  [AMPHENOL_77315-401-02LF]
J13  54-00032  [TENSILITY_54-00032]
R95  33R  [RES_ERA6AHD330V]
R96  33R  [RES_ERA6AHD330V]
R97  33R  [RES_ERA6AHD330V]
R98  33R  [RES_ERA6AHD330V]
R99  2.2K  [RESC1608X50N]
R100  100R  [RES_ERJU14F1000U]
R101  33R  [RES_ERA6AHD330V]
R102  2.2K  [RESC1608X50N]
R103  0R  [RES_ERJH6G0R00V]
R104  10K  [RES_ERA3ARB103V]
R105  1K  [RESC1608X55N]
R106  1K  [RESC1608X55N]

### Nets
GND: B13.10(AGND) B13.41(EP) C260.1 C272.1 C273.1 C274.1 C275.1 C276.1 C277.1 C278.1 C292.2 C294.2 C295.1 C296.1 C299.1 C302.1 C307.1 J13.AA R102.1 R103.1
MICBIAS1: R100.2
VCC_3V0: R104.2
VCCA1V8_CODEC: B13.2(MICBIAS1) B13.8(DACREF) B13.9(AVDD) B13.18(CPVDD) B13.39(DBVDD) C274.2 C275.2 C276.2 C277.2 C302.2
VCCA3V0_CODEC: B13.1(MICVDD) C272.2 C273.2 C296.2
HP_DET_H: C278.2 R104.1 R105.2 ; off-sheet HP_DET_H
HPOR: FL7.2 FL8.2
I2C1_SCL: B13.35(SCL) ; off-sheet I2C1_SCL
I2C1_SDA: B13.36(SDA) ; off-sheet I2C1_SDA
I2S0_LRCK_TX: R97.1 ; off-sheet I2S0_LRCK_TX
I2S0_SCLK: R96.1 ; off-sheet I2S0_SCLK
I2S0_SDI0: R101.2 ; off-sheet I2S0_SDI0
I2S0_SDO0: R98.2 ; off-sheet I2S0_SDO0
I2S_CLK: R95.1 ; off-sheet I2S_CLK
MIC_IN1P: C271.2
MIC_IN2N: C261.1 C270.2 C292.1 J12.1 R102.2
MIC_IN2P: C261.2 C263.2 C294.1 J12.2 R99.1
NetLabel686: B13.23(HPO_L)
NetLabel687: B13.21(HPO_R)
PHONE_DET: B13.37(GPIO1/IRQ1) R106.2
NetB13_5: B13.5(IN2P) C263.1
NetB13_6: B13.6(IN2N/JD2) C270.1
NetB13_7: B13.7(IN3P) C271.1
NetB13_11: B13.11(VREF) C307.2
NetB13_14: B13.14(CPN2) C300.2
NetB13_15: B13.15(CPP2) C300.1
NetB13_16: B13.16(CPN1) C301.1
NetB13_17: B13.17(CPP1) C301.2
NetB13_19: B13.19(CPVPP) C299.2
NetB13_20: B13.20(CPVREF) R103.2
NetB13_22: B13.22(CPVEE) C295.2
NetB13_30: B13.30(ADCDAT1) R101.1
NetB13_31: B13.31(DACDAT1) R98.1
NetB13_32: B13.32(LRCK1) R97.2
NetB13_33: B13.33(BCLK1) R96.2
NetB13_34: B13.34(MCLK) R95.2
NetC260_2: C260.2 R99.2 R100.1
NetFL7_1: FL7.1 J13.A
NetFL8_1: FL8.1 J13.AB
NetJ13_C: J13.C R105.1 R106.1

Not connected (* = marked no-connect by the designer): B13 3(JD1)* 4(IN1P/DMIC_DAT)* 12(LOUTL/P)* 13(LOUTR/N)* 24(PDM_SDA)* 25(PDM_SCL)* 26(ADCDAT2)* 27(DACDAT2)* 28(LRCK2)* 29(BCLK2)* 38(GPIO2/DMIC_SCL)* 40(DCVDD)*; J13 B D

### Library data of the parts
B13 = ALC5651-CGT: high performance, low power, dual I2 S interface audio CODEC Digital-to-Analog Converter with 100dBA SNR; Manufacturer_Name: Realtek; Geometry.Height: 0.9mm; Manufacturer_Part_Number: ALC5651-CGT; Mouser Part Number: *; Mouser Price/Stock: *; Arrow Part Number: *; Arrow Price/Stock: *; Datasheet Link: https://datasheet.lcsc.com/szlcsc/2001151131_Realtek-Semicon-ALC5651-CGT_C474323.pdf
C260 C263 C270 C271 = 0402ZD105KAT4A: as C23 on sheet Regulators and Buck Converters; SnapEDA_Link: https://www.snapeda.com/parts/0402ZD105KAT4A/AVX/view-part/?ref=snap; Package: 1005 AVX; Value: *; MP: 0402ZD105KAT4A; Check_prices: https://www.snapeda.com/parts/0402ZD105KAT4A/AVX/view-part/?ref=eda
C261 C272-C278 = C1005X7R1H104M050BB: Description; Manufacturer_Name: TDK; Copyright: Copyright (C) 2025 Ultra Librarian. All rights reserved.; Manufacturer_Part_Number: C1005X7R1H104M050BB
C292 C294 = C0805C220J5GACTU: as C241 on sheet Regulators and Buck Converters; SnapEDA_Link: https://www.snapeda.com/parts/C0805C220J5GACTU/KEMET/view-part/?ref=snap; Package: 0805 Kemet; Value: *; MF: KEMET; MP: C0805C220J5GACTU; Check_prices: https://www.snapeda.com/parts/C0805C220J5GACTU/KEMET/view-part/?ref=eda
C295 C299 = C1210C105K5RACTU: Capacitor;Ceramic;Cap;1.00uF;Tol+10%;SMT;Vol-Rtg 50V;High Cap.;X7R;TR | KEMET C1210C105K5RACTU; SnapEDA_Link: https://www.snapeda.com/parts/C1210C105K5RACTU/KEMET/view-part/?ref=snap; Package: 1210-2 KEMET; Value: *; MF: KEMET; MP: C1210C105K5RACTU; Check_prices: https://www.snapeda.com/parts/C1210C105K5RACTU/KEMET/view-part/?ref=eda
C296 C300-C302 C307 = CKG57KX7R2A475M335JJ: CAP CER 4.7UF 100V X7R SMD; MF: TDK; Price: None; Purchase-URL: https://pricing.snapeda.com/search/part/CKG57KX7R2A475M335JJ/?ref=eda; SnapEDA_Link: https://www.snapeda.com/parts/CKG57KX7R2A475M335JJ/TDK/view-part/?ref=snap; Availability: In Stock; Value: *; MP: CKG57KX7R2A475M335JJ; Package: 6050 TDK; Check_prices: https://www.snapeda.com/parts/CKG57KX7R2A475M335JJ/TDK/view-part/?ref=eda
FL7 FL8 = BLM15PD121SN1D: 120 Ohms @ 100 MHz 1 Power Line Ferrite Bead 0402 (1005 Metric) 1.3A 90mOhm; MF: Murata; SnapEDA_Link: https://www.snapeda.com/parts/BLM15PD121SN1D/Murata/view-part/?ref=snap; Package: 1005 Taiyo Yuden; Value: *; MP: BLM15PD121SN1D; Check_prices: https://www.snapeda.com/parts/BLM15PD121SN1D/Murata/view-part/?ref=eda
J13 = 54-00032: Connector, 6C audio jack, 3.5xL18.6 mm, PCB mount, 90 degrees, Au plated; MF: Tensility International; SnapEDA_Link: https://www.snapeda.com/parts/54-00032/Tensility+International+Corp/view-part/?ref=snap; Package: None; Value: *; MP: 54-00032; Check_prices: https://www.snapeda.com/parts/54-00032/Tensility+International+Corp/view-part/?ref=eda
R95-R98 R101 = ERA6AHD330V: Package: None; MP: ERA6AHD330V; Price: None; Value: *; Availability: Unavailable
R99 R102 = RR0816P-222-D: RR Series 0603 0.0625 W 2.2 kOhm Â± 0.5% Â±25 ppm/Â°C SMT Metal Film Chip Resistor; MF: Susumu; SnapEDA_Link: https://www.snapeda.com/parts/RR0816P-222-D/Susumu/view-part/?ref=snap; Package: 1608 Susumu; Value: *; MP: RR0816P-222-D; Check_prices: https://www.snapeda.com/parts/RR0816P-222-D/Susumu/view-part/?ref=eda
R100 = ERJU14F1000U: Price: None; Availability: Unavailable; Value: *; MP: ERJU14F1000U; Package: None
R103 = ERJH6G0R00V: MP: ERJH6G0R00V; Value: *; Availability: Unavailable; Price: None; Package: None
R104 = ERA3ARB103V: MP: ERA3ARB103V; Availability: Unavailable; Package: None; Value: *; Price: None
R105 R106 = CRCW06031K00FKECC: 1 kOhms Â±1% 0.1W, 1/10W Chip Resistor 0603 (1608 Metric) - Thick Film; MF: Vishay; SnapEDA_Link: https://www.snapeda.com/parts/CRCW06031K00FKECC/Vishay/view-part/?ref=snap; Package: 0603-2 Vishay; Value: *; MP: CRCW06031K00FKECC; Check_prices: https://www.snapeda.com/parts/CRCW06031K00FKECC/Vishay/view-part/?ref=eda
J12 = 77315-401-02LF: Package: None; Price: None; Value: *; MP: 77315-401-02LF; Availability: Unavailable

## Sheet 40 Pin BS, FAN Connector and Test LEDs.SchDoc
size A4; SheetNumber: 24; SheetTotal: 26
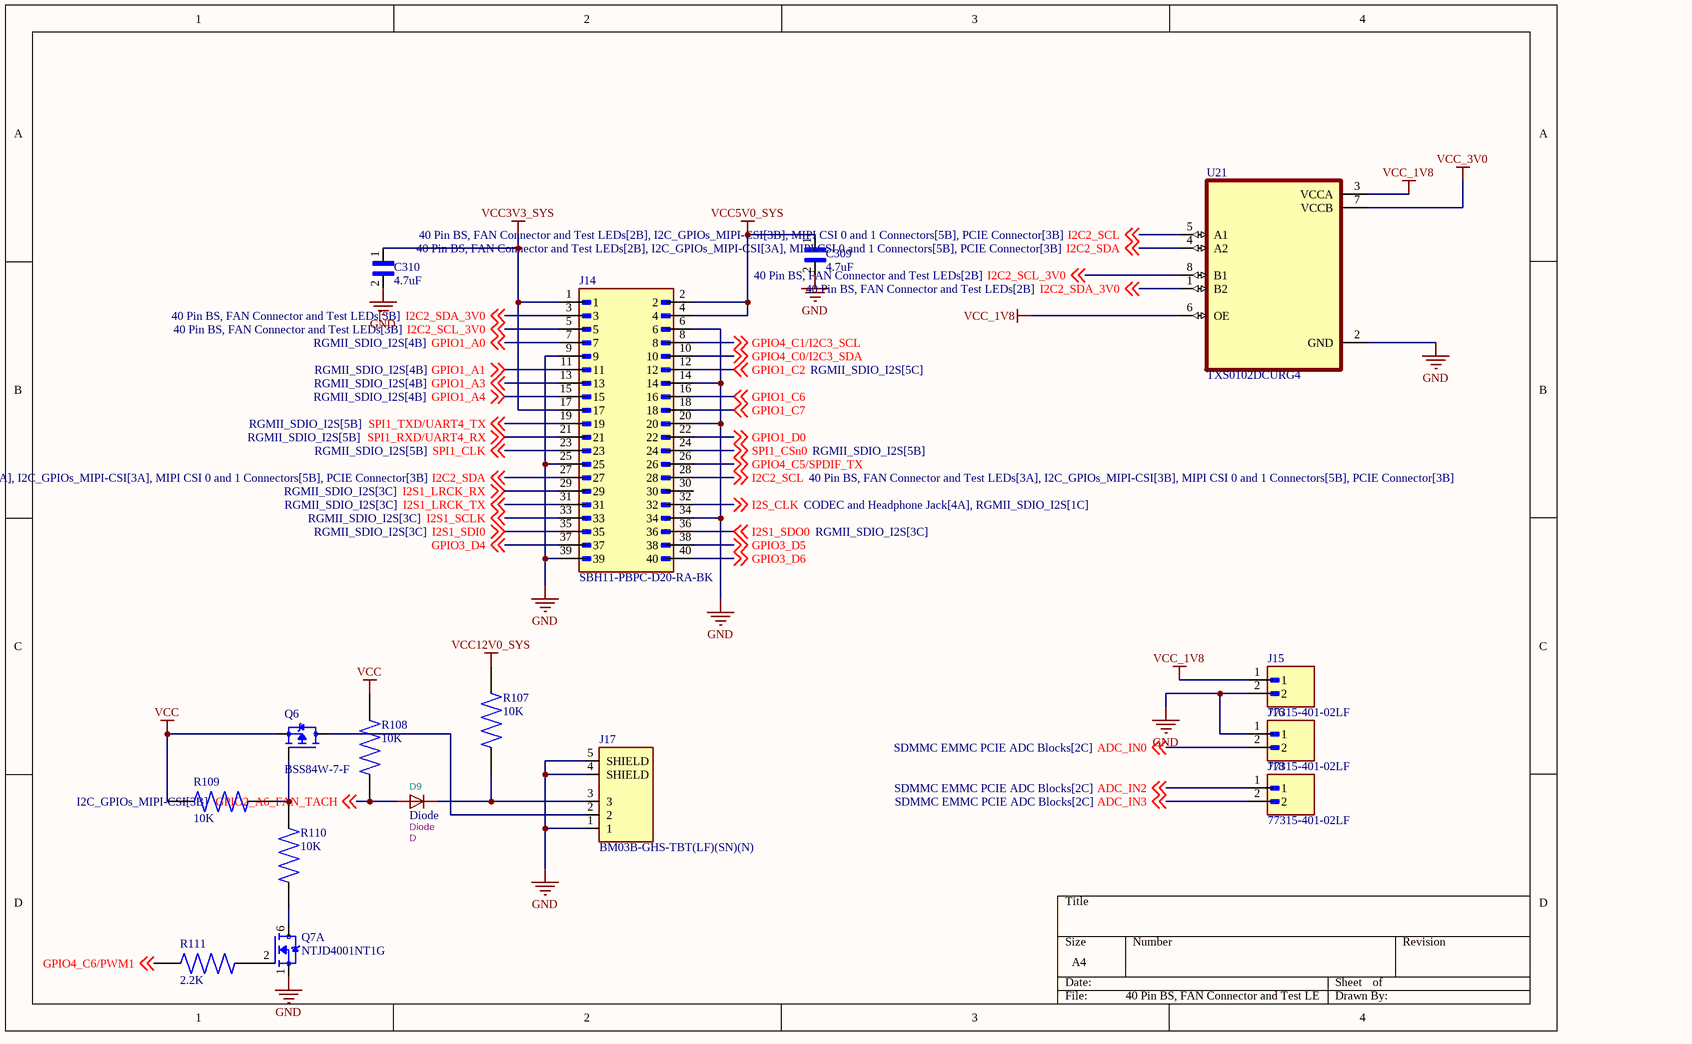
[diagram p23: 40 Pin BS, FAN Connector and Test LEDs.SchDoc]

### Parts
C309  4.7uF  [CAPC6050X350N]
C310  4.7uF  [CAPC6050X350N]
D9  Diode  Reference: D  [SOD-523]
J14  SBH11-PBPC-D20-RA-BK  [SULLINS_SBH11-PBPC-D20-RA-BK]
J15  77315-401-02LF  [AMPHENOL_77315-401-02LF]
J16  77315-401-02LF  [AMPHENOL_77315-401-02LF]
J17  BM03B-GHS-TBT(LF)(SN)(N)  [CONN_BM03B-GHS-TBT(LF)(SN)(N)]
J18  77315-401-02LF  [AMPHENOL_77315-401-02LF]
Q6  BSS84W-7-F  [SOT65P222X110-3N]
Q7  NTJD4001NT1G  [SOT65P210X110-6N]  (part A of 2)
R107  10K  [RES_ERA3ARB103V]
R108  10K  [RES_ERA3ARB103V]
R109  10K  [RES_ERA3ARB103V]
R110  10K  [RES_ERA3ARB103V]
R111  2.2K  [RES_ERA8APB222V]
U21  TXS0102DCURG4  [SOP50P310X90-8N]

### Nets
GND: C309.2 C310.2 J14.6 J14.9 J14.14 J14.20 J14.25 J14.34 J14.39 J15.2 J16.1 J17.1 J17.4(SHIELD) J17.5(SHIELD) Q7.1(S1) U21.2(GND)
VCC: Q6.2(S) R108.2 R109.2
VCC3V3_SYS: C310.1 J14.1 J14.17
VCC5V0_SYS: C309.1 J14.2 J14.4
VCC12V0_SYS: R107.2
VCC_1V8: J15.1 U21.3(VCCA) U21.6(OE)
VCC_3V0: U21.7(VCCB)
ADC_IN0: J16.2 ; off-sheet ADC_IN0
ADC_IN2: J18.1 ; off-sheet ADC_IN2
ADC_IN3: J18.2 ; off-sheet ADC_IN3
GPIO1_A0: J14.7 ; off-sheet GPIO1_A0
GPIO1_A1: J14.11 ; off-sheet GPIO1_A1
GPIO1_A3: J14.13 ; off-sheet GPIO1_A3
GPIO1_A4: J14.15 ; off-sheet GPIO1_A4
GPIO1_C2: J14.12 ; off-sheet GPIO1_C2
GPIO1_C6: J14.16 ; off-sheet GPIO1_C6
GPIO1_C7: J14.18 ; off-sheet GPIO1_C7
GPIO1_D0: J14.22 ; off-sheet GPIO1_D0
GPIO2_A6_FAN_TACH: D9.A R108.1 ; off-sheet GPIO2_A6_FAN_TACH
GPIO3_D4: J14.37 ; off-sheet GPIO3_D4
GPIO3_D5: J14.38 ; off-sheet GPIO3_D5
GPIO3_D6: J14.40 ; off-sheet GPIO3_D6
GPIO4_C0/I2C3_SDA: J14.10 ; off-sheet GPIO4_C0/I2C3_SDA
GPIO4_C1/I2C3_SCL: J14.8 ; off-sheet GPIO4_C1/I2C3_SCL
GPIO4_C5/SPDIF_TX: J14.26 ; off-sheet GPIO4_C5/SPDIF_TX
GPIO4_C6/PWM1: R111.2 ; off-sheet GPIO4_C6/PWM1
I2C2_SCL: J14.28 U21.5(A1) ; off-sheet I2C2_SCL
I2C2_SCL_3V0: J14.5 U21.8(B1) ; off-sheet I2C2_SCL_3V0
I2C2_SDA: J14.27 U21.4(A2) ; off-sheet I2C2_SDA
I2C2_SDA_3V0: J14.3 U21.1(B2) ; off-sheet I2C2_SDA_3V0
I2S1_LRCK_RX: J14.29 ; off-sheet I2S1_LRCK_RX
I2S1_LRCK_TX: J14.31 ; off-sheet I2S1_LRCK_TX
I2S1_SCLK: J14.33 ; off-sheet I2S1_SCLK
I2S1_SDI0: J14.35 ; off-sheet I2S1_SDI0
I2S1_SDO0: J14.36 ; off-sheet I2S1_SDO0
I2S_CLK: J14.32 ; off-sheet I2S_CLK
SPI1_CLK: J14.23 ; off-sheet SPI1_CLK
SPI1_CSn0: J14.24 ; off-sheet SPI1_CSn0
SPI1_RXD/UART4_RX: J14.21 ; off-sheet SPI1_RXD/UART4_RX
SPI1_TXD/UART4_TX: J14.19 ; off-sheet SPI1_TXD/UART4_TX
NetD9_K: D9.K J17.3 R107.1
NetJ17_2: J17.2 Q6.3(D)
NetQ6_1: Q6.1(G) R109.1 R110.1
NetQ7_2: Q7.2(G1) R111.1
NetQ7_6: Q7.6(D1) R110.2

Not connected (* = marked no-connect by the designer): J14 30

### Library data of the parts
C309 C310 = CKG57KX7R2A475M335JJ: CAP CER 4.7UF 100V X7R SMD; MF: TDK; Price: None; Purchase-URL: https://pricing.snapeda.com/search/part/CKG57KX7R2A475M335JJ/?ref=eda; SnapEDA_Link: https://www.snapeda.com/parts/CKG57KX7R2A475M335JJ/TDK/view-part/?ref=snap; Availability: In Stock; Value: *; MP: CKG57KX7R2A475M335JJ; Package: 6050 TDK; Check_prices: https://www.snapeda.com/parts/CKG57KX7R2A475M335JJ/TDK/view-part/?ref=eda
J14 = SBH11-PBPC-D20-RA-BK: Connector Header Through Hole, Right Angle 40 position 0.100 (2.54mm); MF: Sullins Connector; SnapEDA_Link: https://www.snapeda.com/parts/SBH11-PBPC-D20-RA-BK/Sullins+Connector+Solutions/view-part/?ref=snap; Package: None; Value: *; MP: SBH11-PBPC-D20-RA-BK; Check_prices: https://www.snapeda.com/parts/SBH11-PBPC-D20-RA-BK/Sullins+Connector+Solutions/view-part/?ref=eda
J17 = BM03B-GHS-TBT(LF)(SN)(N): Connector Header Surface Mount 3 position 0.049 (1.25mm); MF: JST Sales; SnapEDA_Link: https://www.snapeda.com/parts/BM03B-GHS-TBT(LF)(SN)(N)/JST/view-part/?ref=snap; Package: None; Value: *; MP: BM03B-GHS-TBT(LF)(SN)(N); Check_prices: https://www.snapeda.com/parts/BM03B-GHS-TBT(LF)(SN)(N)/JST/view-part/?ref=eda
Q6 = BSS84W-7-F: as Q4 on sheet Power Supply for CPU Blocks; SnapEDA_Link: https://www.snapeda.com/parts/BSS84W-7-F/Diodes+Inc./view-part/?ref=snap; Availability: In Stock; Check_prices: https://www.snapeda.com/parts/BSS84W-7-F/Diodes+Inc./view-part/?ref=eda; MP: BSS84W-7-F; Price: None; Purchase-URL: https://pricing.snapeda.com/search/part/BSS84W-7-F/?ref=eda; Package: SOT-323 Diodes Inc.; Value: *
Q7 = NTJD4001NT1G: as Q5 on sheet Power Supply for CPU Blocks; SnapEDA_Link: https://www.snapeda.com/parts/NTJD4001NT1G/Onsemi/view-part/?ref=snap; Package: SC-88-6 ON Semiconductor; Value: *; MP: NTJD4001NT1G; Check_prices: https://www.snapeda.com/parts/NTJD4001NT1G/Onsemi/view-part/?ref=eda
R107-R110 = ERA3ARB103V: MP: ERA3ARB103V; Availability: Unavailable; Package: None; Value: *; Price: None
R111 = ERA8APB222V: Availability: Unavailable; Price: None; Package: None; MP: ERA8APB222V; Value: *
U21 = TXS0102DCURG4: 2-Bit Bidirectional Voltage-Level Shifter for Open-Drain and Push-Pull Application; MF: Texas Instruments; SnapEDA_Link: https://www.snapeda.com/parts/TXS0102DCURG4/Texas+Instruments/view-part/?ref=snap; Package: VSSOP-8 Texas Instruments; Value: *; MP: TXS0102DCURG4; Check_prices: https://www.snapeda.com/parts/TXS0102DCURG4/Texas+Instruments/view-part/?ref=eda
D9 = Diode: Datasheet: https://diotec.com/de/produktliste/D.html; ki_keywords: Diode; ki_description: Diode; Value: Diode
J15 J16 J18 = 77315-401-02LF: Package: None; Price: None; Value: *; MP: 77315-401-02LF; Availability: Unavailable

## Sheet PCIE Connector.SchDoc
size A4; SheetNumber: 25; SheetTotal: 26
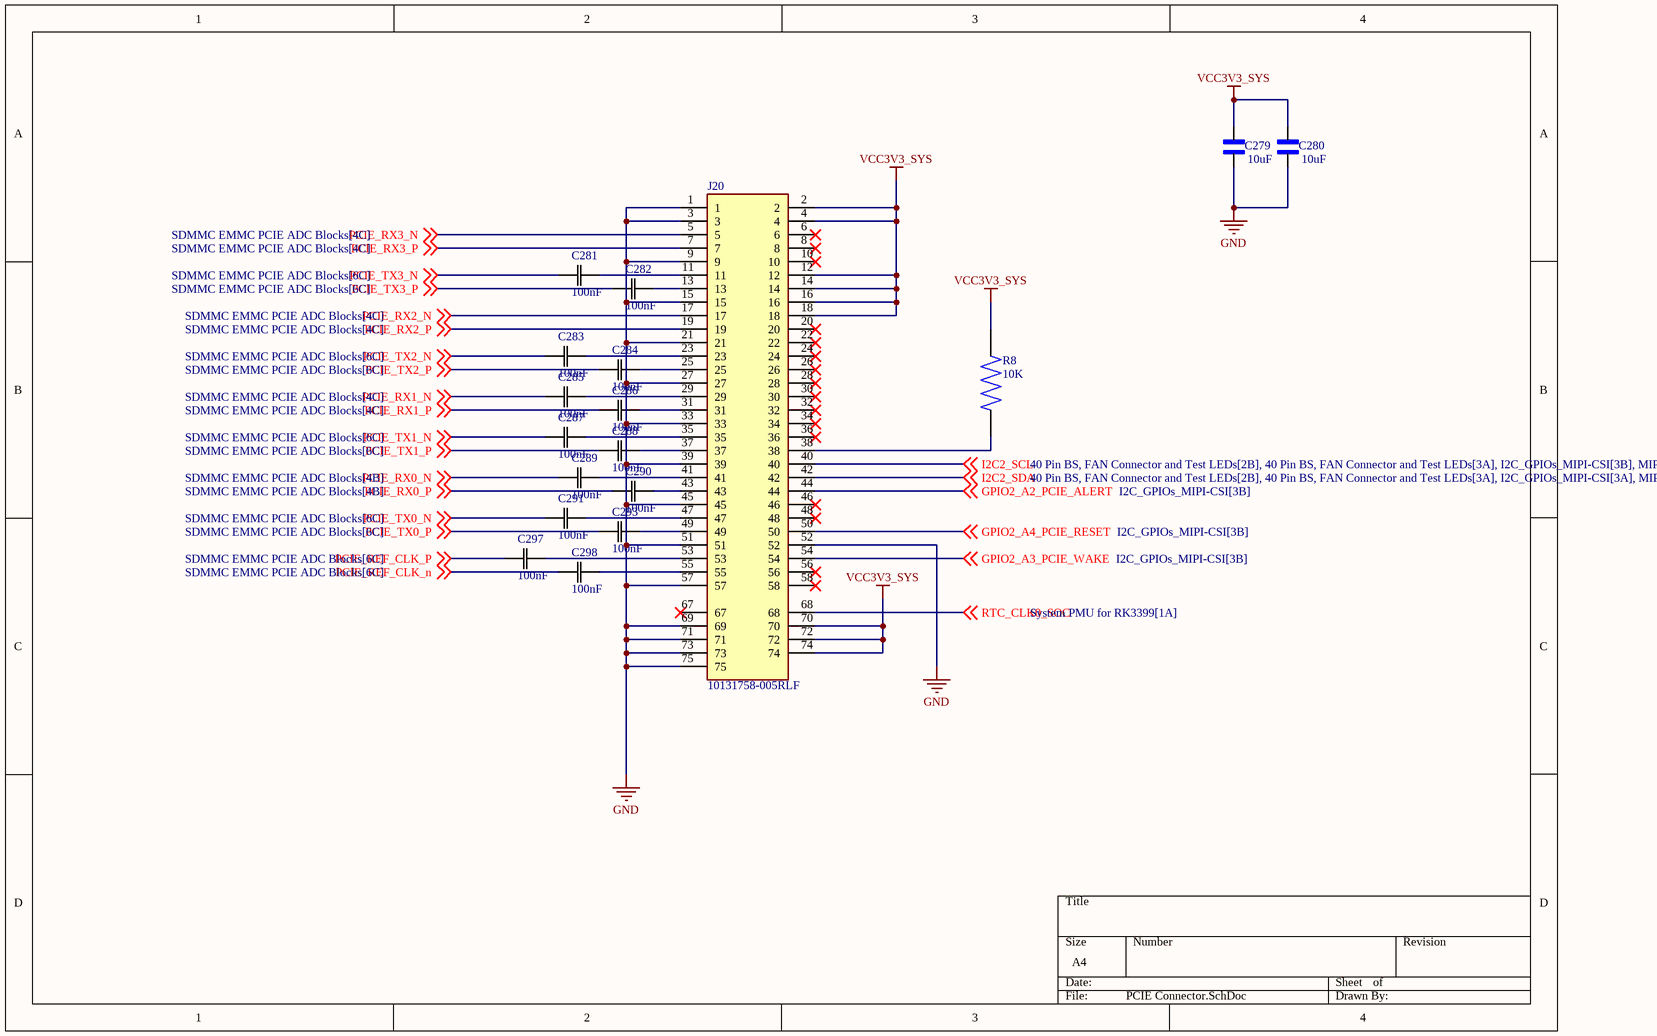
[diagram p24: PCIE Connector.SchDoc]

### Parts
C279  10uF  [CAPC1005X70N]
C280  10uF  [CAPC1005X70N]
C281  100nF  [CAP_1005_TDK]
C282  100nF  [CAP_1005_TDK]
C283  100nF  [CAP_1005_TDK]
C284  100nF  [CAP_1005_TDK]
C285  100nF  [CAP_1005_TDK]
C286  100nF  [CAP_1005_TDK]
C287  100nF  [CAP_1005_TDK]
C288  100nF  [CAP_1005_TDK]
C289  100nF  [CAP_1005_TDK]
C290  100nF  [CAP_1005_TDK]
C291  100nF  [CAP_1005_TDK]
C293  100nF  [CAP_1005_TDK]
C297  100nF  [CAP_1005_TDK]
C298  100nF  [CAP_1005_TDK]
J20  10131758-005RLF  [AMPHENOL_10131758-005RLF]
R8  10K  [RES_ERA3ARB103V]

### Nets
GND: C279.1 C280.1 J20.1 J20.3 J20.9 J20.15 J20.21 J20.27 J20.33 J20.39 J20.45 J20.51 J20.52 J20.57 J20.69 J20.71 J20.73 J20.75
VCC3V3_SYS: C279.2 C280.2 J20.2 J20.4 J20.12 J20.14 J20.16 J20.18 J20.70 J20.72 J20.74 R8.1
GPIO2_A2_PCIE_ALERT: J20.44 ; off-sheet GPIO2_A2_PCIE_ALERT
GPIO2_A3_PCIE_WAKE: J20.54 ; off-sheet GPIO2_A3_PCIE_WAKE
GPIO2_A4_PCIE_RESET: J20.50 ; off-sheet GPIO2_A4_PCIE_RESET
I2C2_SCL: J20.40 ; off-sheet I2C2_SCL
I2C2_SDA: J20.42 ; off-sheet I2C2_SDA
PCIE_REF_CLK_N: C298.2 ; off-sheet PCIE_REF_CLK_n
PCIE_REF_CLK_P: C297.2 ; off-sheet PCIE_REF_CLK_P
PCIE_RX0_N: C289.2 ; off-sheet PCIE_RX0_N
PCIE_RX0_P: C290.2 ; off-sheet PCIE_RX0_P
PCIE_RX1_N: C285.2 ; off-sheet PCIE_RX1_N
PCIE_RX1_P: C286.2 ; off-sheet PCIE_RX1_P
PCIE_RX2_N: J20.17 ; off-sheet PCIE_RX2_N
PCIE_RX2_P: J20.19 ; off-sheet PCIE_RX2_P
PCIE_RX3_N: J20.5 ; off-sheet PCIE_RX3_N
PCIE_RX3_P: J20.7 ; off-sheet PCIE_RX3_P
PCIE_TX0_N: C291.2 ; off-sheet PCIE_TX0_N
PCIE_TX0_P: C293.2 ; off-sheet PCIE_TX0_P
PCIE_TX1_N: C287.2 ; off-sheet PCIE_TX1_N
PCIE_TX1_P: C288.2 ; off-sheet PCIE_TX1_P
PCIE_TX2_N: C283.2 ; off-sheet PCIE_TX2_N
PCIE_TX2_P: C284.2 ; off-sheet PCIE_TX2_P
PCIE_TX3_N: C281.2 ; off-sheet PCIE_TX3_N
PCIE_TX3_P: C282.2 ; off-sheet PCIE_TX3_P
RTC_CLK0_SOC: J20.68 ; off-sheet RTC_CLK0_SOC
NetC281_1: C281.1 J20.11
NetC282_1: C282.1 J20.13
NetC283_1: C283.1 J20.23
NetC284_1: C284.1 J20.25
NetC285_1: C285.1 J20.29
NetC286_1: C286.1 J20.31
NetC287_1: C287.1 J20.35
NetC288_1: C288.1 J20.37
NetC289_1: C289.1 J20.41
NetC290_1: C290.1 J20.43
NetC291_1: C291.1 J20.47
NetC293_1: C293.1 J20.49
NetC297_1: C297.1 J20.53
NetC298_1: C298.1 J20.55
NetJ20_38: J20.38 R8.2

Not connected (* = marked no-connect by the designer): J20 6* 8* 10* 20* 22* 24* 26* 28* 30* 32* 34* 36* 46* 48* 56* 58* 67*

### Library data of the parts
C279 C280 = CL05A106MQ5NUNC: as C26 on sheet Regulators and Buck Converters; SnapEDA_Link: https://www.snapeda.com/parts/CL05A106MQ5NUNC/Samsung/view-part/?ref=snap; Package: SMD-2 Samsung; Value: *; MP: CL05A106MQ5NUNC; Check_prices: https://www.snapeda.com/parts/CL05A106MQ5NUNC/Samsung/view-part/?ref=eda
C281-C291 C293 C297 C298 = C1005X7R1H104M050BB: Description; Manufacturer_Name: TDK; Copyright: Copyright (C) 2025 Ultra Librarian. All rights reserved.; Manufacturer_Part_Number: C1005X7R1H104M050BB
J20 = 10131758-005RLF: PCIe M.2, Storage and Server Connector, H8.50mm, Key M, 0.76&mu;m (30.000&mu;in) Gold Plating, 0.50mm Pitch; MF: Amphenol; Package: None; Price: None; Check_prices: https://www.snapeda.com/parts/10131758-005RLF/Amphenol/view-part/?ref=eda; Value: *; SnapEDA_Link: https://www.snapeda.com/parts/10131758-005RLF/Amphenol/view-part/?ref=snap; MP: 10131758-005RLF; Availability: In Stock; Purchase-URL: https://pricing.snapeda.com/search?q=10131758-005RLF&ref=eda
R8 = ERA3ARB103V: MP: ERA3ARB103V; Availability: Unavailable; Package: None; Value: *; Price: None

## Sheet I2C_GPIOs_MIPI-CSI.SchDoc
size 420 x 297 mm; SheetNumber: 26; SheetTotal: 26
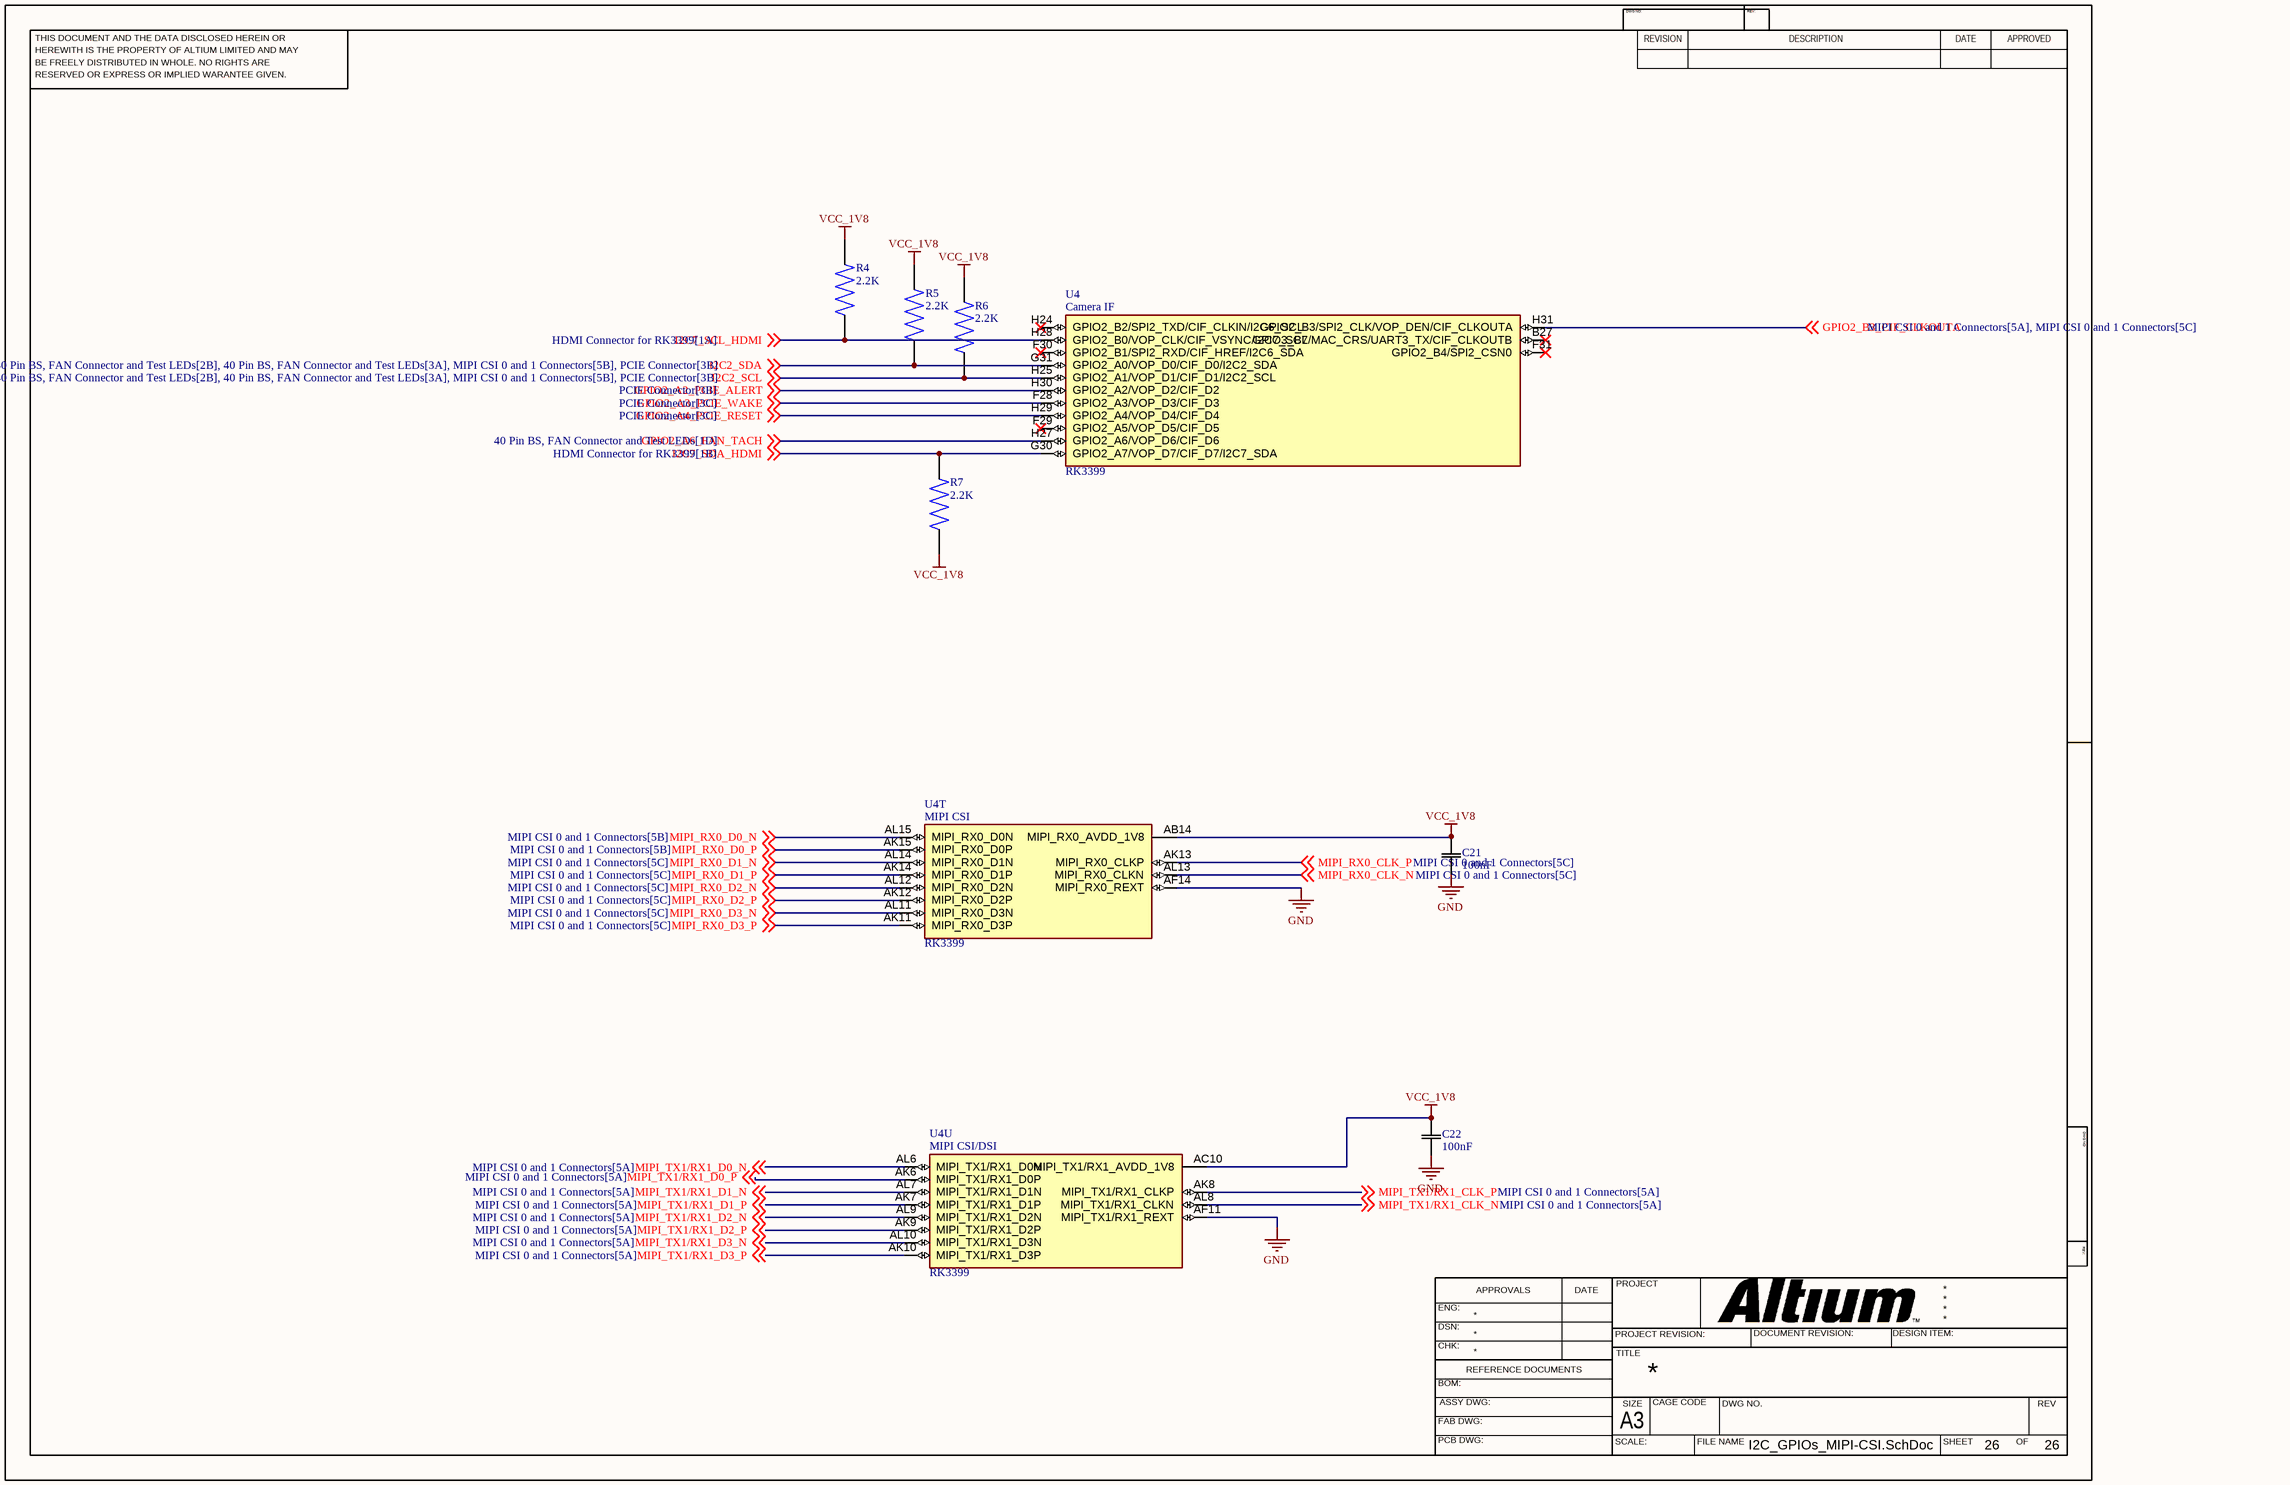
[diagram p25: I2C_GPIOs_MIPI-CSI.SchDoc]

### Parts
C21  100nF  [CAP_1005_TDK]
C22  100nF  [CAP_1005_TDK]
R4  2.2K  [RES_ERA8APB222V]
R5  2.2K  [RES_ERA8APB222V]
R6  2.2K  [RES_ERA8APB222V]
R7  2.2K  [RES_ERA8APB222V]
U4  RK3399  [BGA828C65P31X31_2100X2100X161N]  (parts T,U,28 of 32)

### Nets
GND: C21.1 C22.1 U4.AF11(MIPI_TX1/RX1_REXT) U4.AF14(MIPI_RX0_REXT)
VCC_1V8: C21.2 C22.2 R4.2 R5.2 R6.2 R7.1 U4.AB14(MIPI_RX0_AVDD_1V8) U4.AC10(MIPI_TX1/RX1_AVDD_1V8)
GPIO2_A2_PCIE_ALERT: U4.H30(GPIO2_A2/VOP_D2/CIF_D2) ; off-sheet GPIO2_A2_PCIE_ALERT
GPIO2_A3_PCIE_WAKE: U4.F28(GPIO2_A3/VOP_D3/CIF_D3) ; off-sheet GPIO2_A3_PCIE_WAKE
GPIO2_A4_PCIE_RESET: U4.H29(GPIO2_A4/VOP_D4/CIF_D4) ; off-sheet GPIO2_A4_PCIE_RESET
GPIO2_A6_FAN_TACH: U4.H27(GPIO2_A6/VOP_D6/CIF_D6) ; off-sheet GPIO2_A6_FAN_TACH
GPIO2_B3_CIF_CLKOUTA: U4.H31(GPIO2_B3/SPI2_CLK/VOP_DEN/CIF_CLKOUTA) ; off-sheet GPIO2_B3_CIF_CLKOUTA
I2C2_SCL: R6.1 U4.H25(GPIO2_A1/VOP_D1/CIF_D1/I2C2_SCL) ; off-sheet I2C2_SCL
I2C2_SDA: R5.1 U4.G31(GPIO2_A0/VOP_D0/CIF_D0/I2C2_SDA) ; off-sheet I2C2_SDA
I2C7_SCL_HDMI: R4.1 U4.H28(GPIO2_B0/VOP_CLK/CIF_VSYNC/I2C7_SCL) ; off-sheet I2C7_SCL_HDMI
I2C7_SDA_HDMI: R7.2 U4.G30(GPIO2_A7/VOP_D7/CIF_D7/I2C7_SDA) ; off-sheet I2C7_SDA_HDMI
MIPI_RX0_CLK_N: U4.AL13(MIPI_RX0_CLKN) ; off-sheet MIPI_RX0_CLK_N
MIPI_RX0_CLK_P: U4.AK13(MIPI_RX0_CLKP) ; off-sheet MIPI_RX0_CLK_P
MIPI_RX0_D0_N: U4.AL15(MIPI_RX0_D0N) ; off-sheet MIPI_RX0_D0_N
MIPI_RX0_D0_P: U4.AK15(MIPI_RX0_D0P) ; off-sheet MIPI_RX0_D0_P
MIPI_RX0_D1_N: U4.AL14(MIPI_RX0_D1N) ; off-sheet MIPI_RX0_D1_N
MIPI_RX0_D1_P: U4.AK14(MIPI_RX0_D1P) ; off-sheet MIPI_RX0_D1_P
MIPI_RX0_D2_N: U4.AL12(MIPI_RX0_D2N) ; off-sheet MIPI_RX0_D2_N
MIPI_RX0_D2_P: U4.AK12(MIPI_RX0_D2P) ; off-sheet MIPI_RX0_D2_P
MIPI_RX0_D3_N: U4.AL11(MIPI_RX0_D3N) ; off-sheet MIPI_RX0_D3_N
MIPI_RX0_D3_P: U4.AK11(MIPI_RX0_D3P) ; off-sheet MIPI_RX0_D3_P
MIPI_TX1/RX1_CLK_N: U4.AL8(MIPI_TX1/RX1_CLKN) ; off-sheet MIPI_TX1/RX1_CLK_N
MIPI_TX1/RX1_CLK_P: U4.AK8(MIPI_TX1/RX1_CLKP) ; off-sheet MIPI_TX1/RX1_CLK_P
MIPI_TX1/RX1_D0_N: U4.AL6(MIPI_TX1/RX1_D0N) ; off-sheet MIPI_TX1/RX1_D0_N
MIPI_TX1/RX1_D0_P: U4.AK6(MIPI_TX1/RX1_D0P) ; off-sheet MIPI_TX1/RX1_D0_P
MIPI_TX1/RX1_D1_N: U4.AL7(MIPI_TX1/RX1_D1N) ; off-sheet MIPI_TX1/RX1_D1_N
MIPI_TX1/RX1_D1_P: U4.AK7(MIPI_TX1/RX1_D1P) ; off-sheet MIPI_TX1/RX1_D1_P
MIPI_TX1/RX1_D2_N: U4.AL9(MIPI_TX1/RX1_D2N) ; off-sheet MIPI_TX1/RX1_D2_N
MIPI_TX1/RX1_D2_P: U4.AK9(MIPI_TX1/RX1_D2P) ; off-sheet MIPI_TX1/RX1_D2_P
MIPI_TX1/RX1_D3_N: U4.AL10(MIPI_TX1/RX1_D3N) ; off-sheet MIPI_TX1/RX1_D3_N
MIPI_TX1/RX1_D3_P: U4.AK10(MIPI_TX1/RX1_D3P) ; off-sheet MIPI_TX1/RX1_D3_P

Not connected (* = marked no-connect by the designer): U4 B27(GPIO3_B7/MAC_CRS/UART3_TX/CIF_CLKOUTB)* F29(GPIO2_A5/VOP_D5/CIF_D5)* F30(GPIO2_B1/SPI2_RXD/CIF_HREF/I2C6_SDA)* F31(GPIO2_B4/SPI2_CSN0)* H24(GPIO2_B2/SPI2_TXD/CIF_CLKIN/I2C6_SCL)*

### Notes on the sheet
- THIS DOCUMENT AND THE DATA DISCLOSED HEREIN OR
- HEREWITH IS THE PROPERTY OF ALTIUM LIMITED AND MAY
- DWG NO:
- REVISION
- REV:
- DESCRIPTION
- DATE
- APPROVED
- BE FREELY DISTRIBUTED IN WHOLE. NO RIGHTS ARE
- RESERVED OR EXPRESS OR IMPLIED WARANTEE GIVEN.
- ENG:
- APPROVALS
- PROJECT
- DSN:
- CHK:
- REFERENCE DOCUMENTS
- PROJECT REVISION:
- TITLE
- DOCUMENT REVISION:
- DESIGN ITEM:
- BOM:
- FAB DWG:
- PCB DWG:
- ASSY DWG:
- SCALE:
- A3
- SIZE
- CAGE CODE
- FILE NAME
- DWG NO.
- SHEET
- OF
- REV
- (in symbol RK3399, part T) MIPI CSI
- (in symbol RK3399, part U) MIPI CSI/DSI
- (in symbol RK3399, part 28) Camera IF

### Library data of the parts
C21 C22 = C1005X7R1H104M050BB: Description; Manufacturer_Name: TDK; Copyright: Copyright (C) 2025 Ultra Librarian. All rights reserved.; Manufacturer_Part_Number: C1005X7R1H104M050BB
R4-R7 = ERA8APB222V: Availability: Unavailable; Price: None; Package: None; MP: ERA8APB222V; Value: *
U4 = RK3399: RK3399 ROCK Pi 4 Model A 2GB - ARMÂ® CortexÂ®-A53, CortexÂ®-A72 MPU Embedded Evaluation Board; MF: Rockchip; SnapEDA_Link: https://www.snapeda.com/parts/RK3399/Fuzhou+Rockchip+Electronics+Co/view-part/?ref=snap; Package: Seeed Technology; MP: RK3399; Check_prices: https://www.snapeda.com/parts/RK3399/Fuzhou+Rockchip+Electronics+Co/view-part/?ref=eda; Price: None; Value: *; Availability: Not in stock